# EAGLE design DL-1 (EAGLE 9.6.2)
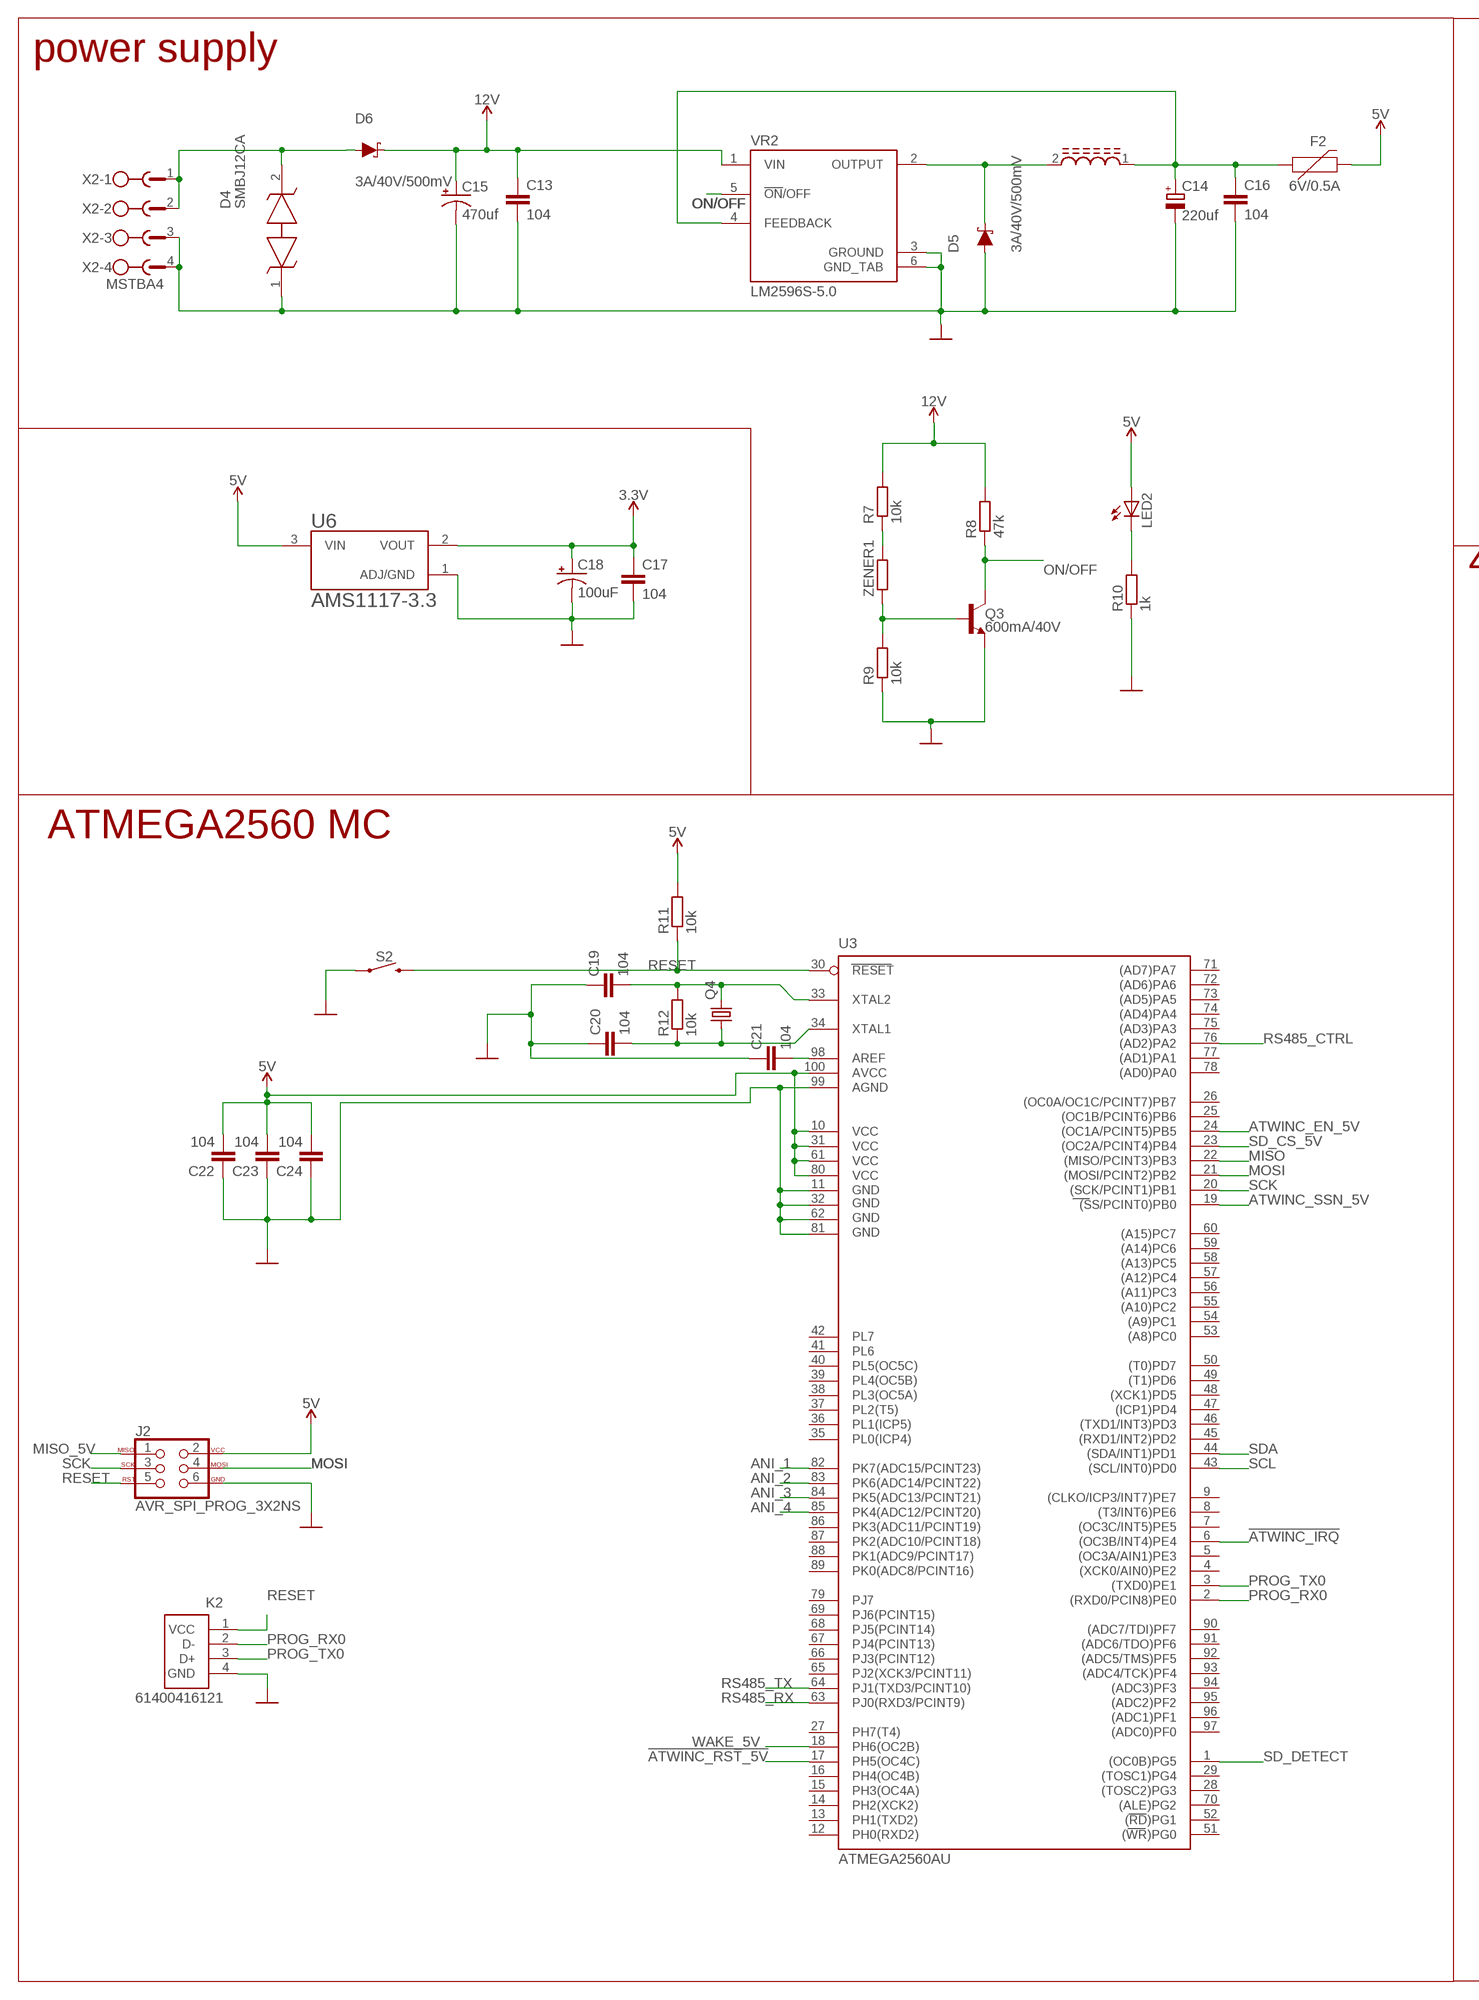
[diagram p0: schematic, sheet 1, part 1 of 2]
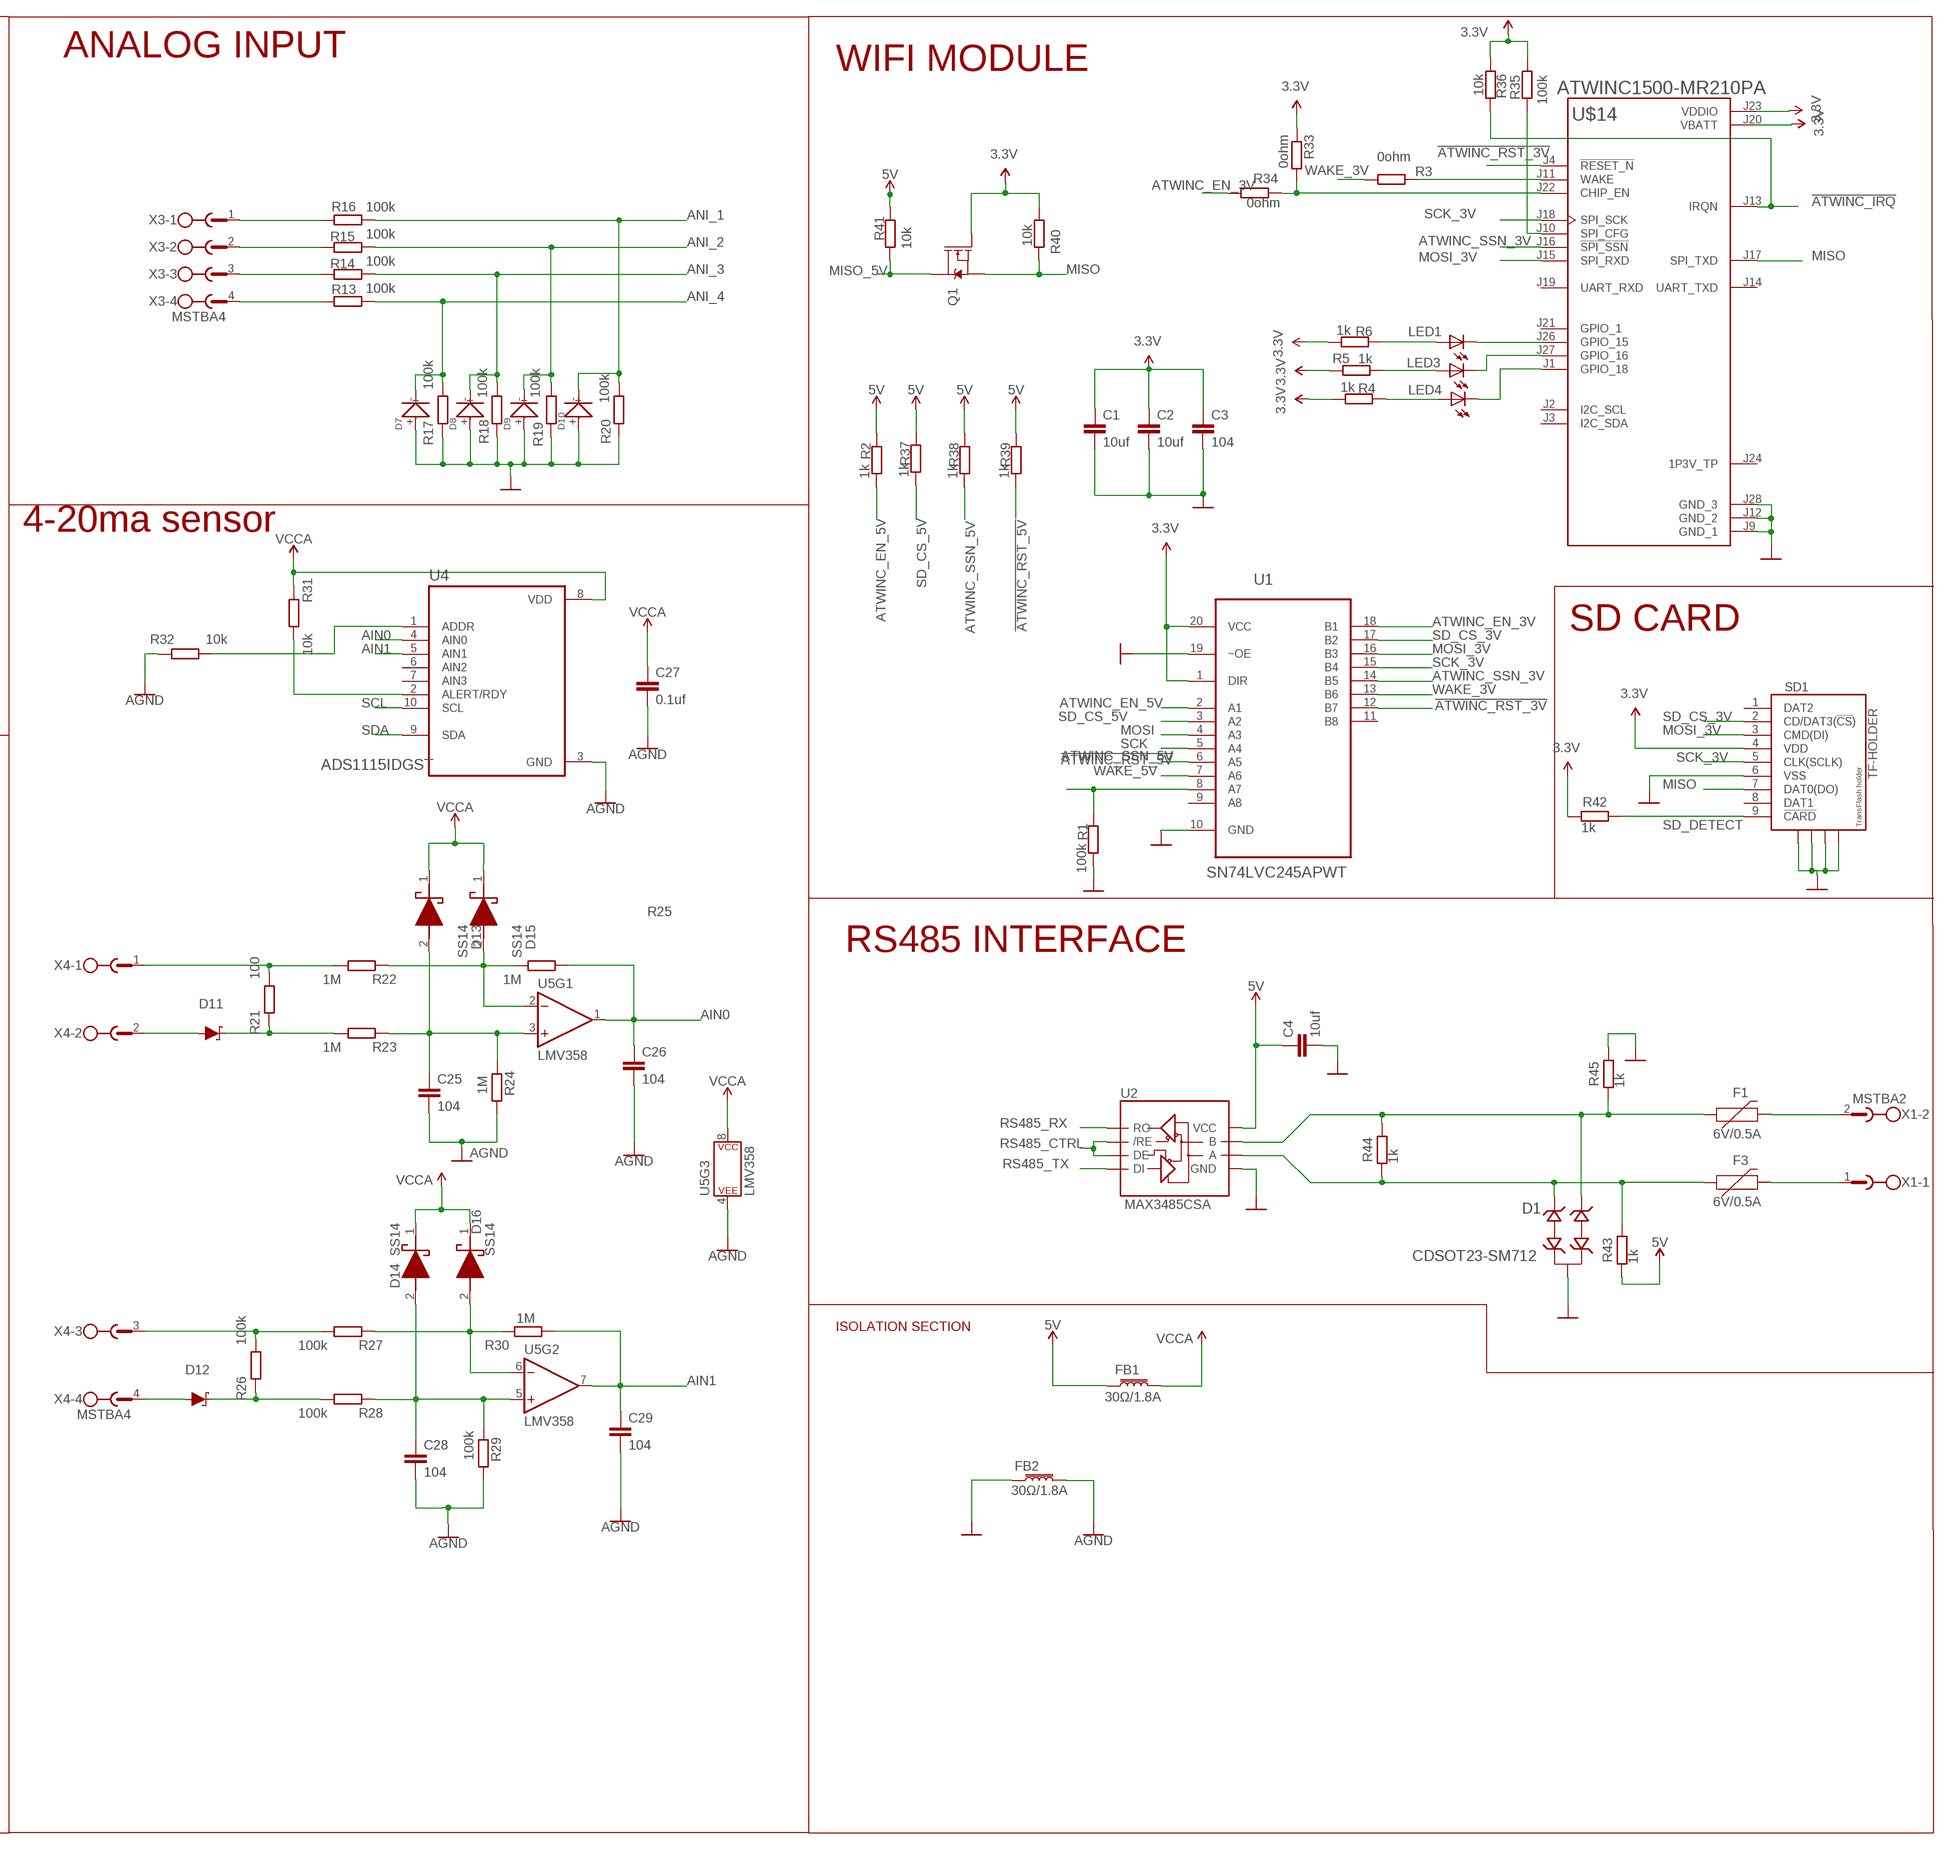
[diagram p1: schematic, sheet 1, part 2 of 2]

## Parts
C1  10uf  C-EUC0805  [C0805]
C2  10uf  C-EUC0805  [C0805]
C3  104  C-EUC0805  [C0805]
C4  10uf  C-EUC0805  [C0805]
C13  104  C-EUC0805  [C0805]
C14  220uf  CPOL-EU153CLV-1014  [153CLV-1014]
C15  470uf  CPOL-USE5-8.5  [E5-8,5]
C16  104  C-EUC0805  [C0805]
C17  104  C-EUC0805  [C0805]
C18  100uF  100UF-POLAR-10X10.5-63V-20%  [NIC_10X10.5_CAP]
C19  104  C-EUC0805  [C0805]
C20  104  C-EUC0805  [C0805]
C21  104  C-EUC0805  [C0805]
C22  104  C-EUC0805  [C0805]
C23  104  C-EUC0805  [C0805]
C24  104  C-EUC0805  [C0805]
C25  104  C-EUC0805  [C0805]
C26  104  C-EUC0805  [C0805]
C27  0.1uf  C-EUC0805  [C0805]
C28  104  C-EUC0805  [C0805]
C29  104  C-EUC0805  [C0805]
D1  CDSOT23-SM712  [SOT-23-3]
D4  SMBJ12CA  [DIONM5443X244N]
D5  3A/40V/500mV  DIODE-SCHOTTKY-B340A  [SMA-DIODE]
D6  3A/40V/500mV  DIODE-SCHOTTKY-B340A  [SMA-DIODE]
D7  SMD-DIODE-ZENER-5.1V-500MW(SOD-123)  [SOD-123]
D8  SMD-DIODE-ZENER-5.1V-500MW(SOD-123)  [SOD-123]
D9  SMD-DIODE-ZENER-5.1V-500MW(SOD-123)  [SOD-123]
D10  SMD-DIODE-ZENER-5.1V-500MW(SOD-123)  [SOD-123]
D11  3A/40V/500mV  DIODE-SCHOTTKY-B340A  [SMA-DIODE]
D12  3A/40V/500mV  DIODE-SCHOTTKY-B340A  [SMA-DIODE]
D13  SS14  [DIOM5227X270N]
D14  SS14  [DIOM5227X270N]
D15  SS14  [DIOM5227X270N]
D16  SS14  [DIOM5227X270N]
F1  6V/0.5A  PPTC_HALF-AMP  [1206]
F2  6V/0.5A  PPTC_HALF-AMP  [1206]
F3  6V/0.5A  PPTC_HALF-AMP  [1206]
FB1  30Ω/1.8A  FERRITE_BEAD-0603  [0603]
FB2  30Ω/1.8A  FERRITE_BEAD-0603  [0603]
J2  AVR_SPI_PROG_3X2NS  [2X3-NS]
K2  61400416121  [61400416121]
L2  SRR1260-680M  [INDP125125X600N]
LED1  LEDCHIP-LED0805  [CHIP-LED0805]
LED2  LEDCHIP-LED0805  [CHIP-LED0805]
LED3  LEDCHIP-LED0805  [CHIP-LED0805]
LED4  LEDCHIP-LED0805  [CHIP-LED0805]
Q1  220mA/50V/3.5Ω  MOSFET-NCH-BSS138  [SOT23-3]
Q3  600mA/40V  TRANS_NPN-MMBT2222AL  [SOT23-3]
Q4  CRYSTALHC49S  [HC49/S]
R1  100k  R-EU_M0805  [M0805]
R2  1k  R-EU_M0805  [M0805]
R3  0ohm  R-EU_M0805  [M0805]
R4  1k  R-EU_M0805  [M0805]
R5  1k  R-EU_M0805  [M0805]
R6  1k  R-EU_M0805  [M0805]
R7  10k  R-EU_M0805  [M0805]
R8  47k  R-EU_M0805  [M0805]
R9  10k  R-EU_M0805  [M0805]
R10  1k  R-EU_M0805  [M0805]
R11  10k  R-EU_M0805  [M0805]
R12  10k  R-EU_M0805  [M0805]
R13  100k  R-EU_M0805  [M0805]
R14  100k  R-EU_M0805  [M0805]
R15  100k  R-EU_M0805  [M0805]
R16  100k  R-EU_M0805  [M0805]
R17  100k  R-EU_M0805  [M0805]
R18  100k  R-EU_M0805  [M0805]
R19  100k  R-EU_M0805  [M0805]
R20  100k  R-EU_M0805  [M0805]
R21  100  R-EU_M0805  [M0805]
R22  1M  R-EU_M0805  [M0805]
R23  1M  R-EU_M0805  [M0805]
R24  1M  R-EU_M0805  [M0805]
R25  1M  R-EU_M0805  [M0805]
R26  100k  R-EU_M0805  [M0805]
R27  100k  R-EU_M0805  [M0805]
R28  100k  R-EU_M0805  [M0805]
R29  100k  R-EU_M0805  [M0805]
R30  1M  R-EU_M0805  [M0805]
R31  10k  R-EU_M0805  [M0805]
R32  10k  R-EU_M0805  [M0805]
R33  0ohm  R-EU_M0805  [M0805]
R34  0ohm  R-EU_M0805  [M0805]
R35  100k  R-EU_M0805  [M0805]
R36  10k  R-EU_M0805  [M0805]
R37  1k  R-EU_M0805  [M0805]
R38  1k  R-EU_M0805  [M0805]
R39  1k  R-EU_M0805  [M0805]
R40  10k  R-EU_M0805  [M0805]
R41  10k  R-EU_M0805  [M0805]
R42  1k  R-EU_M0805  [M0805]
R43  1k  R-EU_M0805  [M0805]
R44  1k  R-EU_M0805  [M0805]
R45  1k  R-EU_M0805  [M0805]
S2  MOMENTARY-SWITCH-SPST-SMD-6.0X3.5MM  [TACTILE_SWITCH_SMD_6.0X3.5MM]
SD1  TF-HOLDER  [TF-PULL]
U1  SN74LVC245APWT  [SOP65P640X120-20N]
U2  MAX3485CSA  RS485SOIC  [SO08]
U3  ATMEGA2560AU  [TQFP100]
U4  ADS1115IDGST  [SOP50P490X110-10N]
U5  LMV358  LMV358SOIC  [SO08]
U6  AMS1117-3.3  [SOT229P700X180-4N]
U$14  ATWINC1500-MR210PA  [ATMEL_ATWINC1500-MR210PA]
VR2  LM2596S-5.0  [TO170P1524X483-6N]
X1  MSTBA2  [MSTBA2]
X2  MSTBA4  [MSTBA4]
X3  MSTBA4  [MSTBA4]
X4  MSTBA4  [MSTBA4]
ZENER1  R-EU_0204/7  [0204/7]

## Nets
3.3V: C1.1 C2.1 C3.1 C17.1 C18.+ Q1.1(G) R4.2 R5.2 R6.2 R33.1 R35.1 R36.1 R40.1 R42.1 SD1.4(VDD) U1.1(DIR) U1.20(VCC) U6.2(VOUT) U$14.J20(VBATT) U$14.J23(VDDIO)
5V: C4.1 C22.2 C23.2 C24.2 F2.2 FB1.1 J2.2 LED2.A R2.1 R11.2 R37.1 R38.1 R39.1 R41.1 R43.1 U2.8(VCC) U3.10(VCC) U3.31(VCC1) U3.61(VCC2) U3.80(VCC3) U3.100(AVCC) U6.3(VIN)
12V: C13.1 C15.+ D6.C R7.2 R8.2 VR2.1(VIN)
!ATWINC_IRQ: R36.2 U3.6((OC3B/INT4)PE4) U$14.J13(IRQN)
!ATWINC_RST_3V: U1.12(B7) U$14.J4(!RESET_N)
!ATWINC_RST_5V: R1.1 R39.2 U1.8(A7) U3.17(PH5(OC4C))
AGND: C25.2 C26.2 C27.2 C28.2 C29.2 FB2.2 R24.1 R29.1 R32.1 U4.3(GND) U5.4(P$V-)
AIN0: C26.1 R25.1 U4.4(AIN0) U5.1(OUT)
AIN1: C29.1 R30.1 U4.5(AIN1) U5.7(OUT)
ANI_1: D10.- R16.1 R20.2 U3.82(PK7(ADC15/PCINT23))
ANI_2: D9.- R15.1 R19.2 U3.83(PK6(ADC14/PCINT22))
ANI_3: D8.- R14.1 R18.2 U3.84(PK5(ADC13/PCINT21))
ANI_4: D7.- R13.1 R17.2 U3.85(PK4(ADC12/PCINT20))
ATWINC_EN_3V: R34.1 U1.18(B1)
ATWINC_EN_5V: R2.2 U1.2(A1) U3.24((OC1A/PCINT5)PB5)
ATWINC_SSN_3V: U1.14(B5) U$14.J16(!SPI_SSN)
ATWINC_SSN_5V: R38.2 U1.6(A5) U3.19((SS/PCINT0)PB0)
GND: C1.2 C2.2 C3.2 C4.2 C13.2 C14.- C15.- C16.2 C17.2 C18.- C19.1 C20.1 C21.1 C22.1 C23.1 C24.1 D1.3(GND) D4.1 D5.A D7.+ D8.+ D9.+ D10.+ FB2.1 J2.6 K2.4(GND) Q3.2(E) R1.2 R9.1 R10.1 R17.1 R18.1 R19.1 R20.1 R45.2 S2.1 SD1.6(VSS) SD1.S1 SD1.S2 SD1.S3 SD1.S4 U1.10(GND) U1.19(~OE) U2.5(GND) U3.11(GND) U3.32(GND1) U3.62(GND2) U3.81(GND3) U3.99(AGND) U6.1(ADJ/GND) U$14.J9(GND_1) U$14.J12(GND_2) U$14.J28(GND_3) VR2.3(GROUND) VR2.6(GND_TAB) X2.3 X2.4
MISO: Q1.2(S) R40.2 SD1.7(DAT0(DO)) U3.22((MISO/PCINT3)PB3) U$14.J17(SPI_TXD)
MISO_5V: J2.1 Q1.3(D) R41.2
MOSI: J2.4 U1.4(A3) U3.21((MOSI/PCINT2)PB2)
MOSI_3V: SD1.3(CMD(DI)) U1.16(B3) U$14.J15(SPI_RXD)
N$1: LED1.C U$14.J26(GPIO_15)
N$2: LED3.C U$14.J27(GPIO_16)
N$3: D5.C L2.2 VR2.2(OUTPUT)
N$4: LED3.A R5.1
N$5: LED1.A R6.1
N$6: LED4.C U$14.J1(GPIO_18)
N$7: LED4.A R4.1
N$8: D1.2(IO2) F1.1 R44.2 R45.1 U2.7(B)
N$9: R3.1 U$14.J11(WAKE)
N$10: R35.2 U$14.J10(SPI_CFG)
N$11: C14.+ C16.1 F2.1 L2.1 VR2.4(FEEDBACK)
N$12: D4.2 D6.A X2.1 X2.2
N$13: LED2.C R10.2
N$14: Q3.1(B) R9.2 ZENER1.1
N$15: R7.1 ZENER1.2
N$16: C20.2 Q4.1 R12.1 U3.34(XTAL1)
N$17: C19.2 Q4.2 R12.2 U3.33(XTAL2)
N$18: C21.2 U3.98(AREF)
N$19: R13.2 X3.4
N$20: R14.2 X3.3
N$21: R15.2 X3.2
N$22: R16.2 X3.1
N$23: R21.2 R22.2 X4.1
N$24: D11.C R21.1 R23.2
N$25: C25.1 D13.2(A) R23.1 R24.2 U5.3(+IN)
N$26: D15.2(A) R22.1 R25.2 U5.2(-IN)
N$27: D11.A X4.2
N$28: R26.2 R27.2 X4.3
N$29: D12.C R26.1 R28.2
N$30: C28.1 D14.2(A) R28.1 R29.2 U5.5(+IN)
N$31: D16.2(A) R27.1 R30.2 U5.6(-IN)
N$32: D12.A X4.4
N$33: R31.2 U4.2(ALERT/RDY)
N$34: R32.2 U4.1(ADDR)
N$35: D1.1(IO1) F3.1 R43.2 R44.1 U2.6(A)
N$36: R33.2 R34.2 U$14.J22(CHIP_EN)
N$37: F1.2 X1.2
N$38: F3.2 X1.1
ON/OFF: Q3.3(C) R8.1 VR2.5(!ON!/OFF)
PROG_RX0: K2.2(D-) U3.2((RXD0/PCIN8)PE0)
PROG_TX0: K2.3(D+) U3.3((TXD0)PE1)
RESET: J2.5 K2.1(VCC) R11.1 S2.2 U3.30(RESET)
RS485_CTRL: U2.2(/RE) U2.3(DE) U3.76((AD2)PA2)
RS485_RX: U2.1(RO) U3.63(PJ0(RXD3/PCINT9))
RS485_TX: U2.4(DI) U3.64(PJ1(TXD3/PCINT10))
SCK: J2.3 U1.5(A4) U3.20((SCK/PCINT1)PB1)
SCK_3V: SD1.5(CLK(SCLK)) U1.15(B4) U$14.J18(SPI_SCK)
SCL: U3.43((SCL/INT0)PD0) U4.10(SCL)
SD_CS_3V: SD1.2(CD/DAT3(!CS!)) U1.17(B2)
SD_CS_5V: R37.2 U1.3(A2) U3.23((OC2A/PCINT4)PB4)
SD_DETECT: R42.2 SD1.9(!CARD) U3.1((OC0B)PG5)
SDA: U3.44((SDA/INT1)PD1) U4.9(SDA)
VCCA: C27.1 D13.1(K) D14.1(K) D15.1(K) D16.1(K) FB1.2 R31.1 U4.8(VDD) U5.8(P$V+)
WAKE_3V: R3.2 U1.13(B6)
WAKE_5V: U1.7(A6) U3.18(PH6(OC2B))
Unconnected: SD1.1(DAT2) SD1.8(DAT1) U1.9(A8) U1.11(B8) U3.4((XCK0/AIN0)PE2) U3.5((OC3A/AIN1)PE3) U3.7((OC3C/INT5)PE5) U3.8((T3/INT6)PE6) U3.9((CLKO/ICP3/INT7)PE7) U3.12(PH0(RXD2)) U3.13(PH1(TXD2)) U3.14(PH2(XCK2)) U3.15(PH3(OC4A)) U3.16(PH4(OC4B)) U3.25((OC1B/PCINT6)PB6) U3.26((OC0A/OC1C/PCINT7)PB7) U3.27(PH7(T4)) U3.28((TOSC2)PG3) U3.29((TOSC1)PG4) U3.35(PL0(ICP4)) U3.36(PL1(ICP5)) U3.37(PL2(T5)) U3.38(PL3(OC5A)) U3.39(PL4(OC5B)) U3.40(PL5(OC5C)) U3.41(PL6) U3.42(PL7) U3.45((RXD1/INT2)PD2) U3.46((TXD1/INT3)PD3) U3.47((ICP1)PD4) U3.48((XCK1)PD5) U3.49((T1)PD6) U3.50((T0)PD7) U3.51((WR)PG0) U3.52((RD)PG1) U3.53((A8)PC0) U3.54((A9)PC1) U3.55((A10)PC2) U3.56((A11)PC3) U3.57((A12)PC4) U3.58((A13)PC5) U3.59((A14)PC6) U3.60((A15)PC7) U3.65(PJ2(XCK3/PCINT11)) U3.66(PJ3(PCINT12)) U3.67(PJ4(PCINT13)) U3.68(PJ5(PCINT14)) U3.69(PJ6(PCINT15)) U3.70((ALE)PG2) U3.71((AD7)PA7) U3.72((AD6)PA6) U3.73((AD5)PA5) U3.74((AD4)PA4) U3.75((AD3)PA3) U3.77((AD1)PA1) U3.78((AD0)PA0) U3.79(PJ7) U3.86(PK3(ADC11/PCINT19)) U3.87(PK2(ADC10/PCINT18)) U3.88(PK1(ADC9/PCINT17)) U3.89(PK0(ADC8/PCINT16)) U3.90((ADC7/TDI)PF7) U3.91((ADC6/TDO)PF6) U3.92((ADC5/TMS)PF5) U3.93((ADC4/TCK)PF4) U3.94((ADC3)PF3) U3.95((ADC2)PF2) U3.96((ADC1)PF1) U3.97((ADC0)PF0) U4.6(AIN2) U4.7(AIN3) U$14.J2(I2C_SCL) U$14.J3(I2C_SDA) U$14.J14(UART_TXD) U$14.J19(UART_RXD) U$14.J21(GPIO_1) U$14.J24(1P3V_TP)

## Notes on the sheet
- power supply
- ANALOG INPUT
- WIFI MODULE
- 4-20ma sensor
- SD CARD
- ATMEGA2560 MC
- RS485 INTERFACE
- ISOLATION SECTION

## Library data of the parts
C1-C4 C13 C16 C17 C19-C29 = rcl:C-EU: CAPACITOR, European symbol; SPICEPREFIX: C
C14 = rcl:CPOL-EU: POLARIZED CAPACITOR, European symbol; SPICEPREFIX: C
C15 = rcl:CPOL-US: POLARIZED CAPACITOR, American symbol; SPICEPREFIX: C
C18 = SparkFun-Capacitors:100UF-POLAR: 100µF polarized capacitors A capacitor is a passive two-terminal electrical component used to store electrical energy temporarily in an electric field.; PROD_ID: CAP-08362
D1 = PC_Diode_SM712 TVS RS485:CDSOT23-SM712: Bourns CDSOT23-SM712 http://www.bourns.com/docs/Product-Datasheets/CDSOT23-SM712.pdf TVS Protection Didoe for RS-485 as recommended by TI in their RS-485 Reference Guide: http://www.ti.com/lit/sg/slyt484a/slyt484a.pdf; AVAILABILITY: Unavailable; DESCRIPTION: Diode, Smt Tvs Array, 7vrwm & 12vrwm, Sot23 Package; MF: Bourns; MP: CDSOT23-SM712; PACKAGE: SOT-23 Bourns; PRICE: None
D4 = SMBJ12CA:SMBJ12CA: BOURNS - SMBJ12CA - TVS DIODE, 600W, 12V, BIDIR, DO-214AA Source: Datasheet <https://www.mouser.com/ds/2/54/mbj-778392.pdf>; ARROW_PART_NUMBER: SMBJ12CA; ARROW_PRICE-STOCK: https://www.arrow.com/en/products/smbj12ca/bourns; DESCRIPTION: BOURNS - SMBJ12CA - TVS DIODE, 600W, 12V, BIDIR, DO-214AA; HEIGHT: 2.44mm; MANUFACTURER_NAME: Bourns; MANUFACTURER_PART_NUMBER: SMBJ12CA; MOUSER_PART_NUMBER: 652-SMBJ12CA; MOUSER_PRICE-STOCK: https://www.mouser.co.uk/ProductDetail/Bourns/SMBJ12CA/?qs=d7fLapxX37HuPPjHuz97DA%3D%3D
D5 D6 D11 D12 = SparkFun-DiscreteSemi:DIODE-SCHOTTKY: Schottky diode A Schottky diode is a semiconductor diode which has a low forward voltage drop and a very fast switching action.; PROD_ID: DIO-09886
D7-D10 = PC_Diode-Zener-5.1V:SMD-DIODE-ZENER-5.1V-500MW(SOD-123): 304030015; AVAILABILITY: Unavailable; DESCRIPTION: SMD Diode Zener 51.V-500mW; MF: Vishay; MP: MMSZ4689-V-GS08; PACKAGE: SOD-123 Vishay; PRICE: None
D13-D16 = SS14:SS14: 1.0 A Schottky Barrier Rectifiers Source: Datasheet <http://www.onsemi.com/pub/Collateral/SS19-D.pdf>; ARROW_PART_NUMBER: SS14; ARROW_PRICE-STOCK: https://www.arrow.com/en/products/ss14/on-semiconductor; DESCRIPTION: 1.0 A Schottky Barrier Rectifiers; HEIGHT: 2.7mm; MANUFACTURER_NAME: ON Semiconductor; MANUFACTURER_PART_NUMBER: SS14; MOUSER_PART_NUMBER: 512-SS14; MOUSER_PRICE-STOCK: https://www.mouser.co.uk/ProductDetail/ON-Semiconductor-Fairchild/SS14?qs=mVVXn4M53U%252BvrBaFv5vr4w%3D%3D
F1-F3 = SparkFun-Fuses:PPTC: Resettable Fuse PPTC Resettable Fuse. Really a sort of resistor with a polymeric positive temperature coefficient whose resistance increases dramatically with an increase in temperature. When heated by the power passing through the resistance rises causing the current to be limited, protecting the circuit. This is achieved by the transition of the polymer from a crystalline to an amorphous state where the conductive carbon separates breaking the conductive pathways found in the cool crystalline structure. When a PPTC cools back down it resumes conducting letting the circuit turn back on. SparkFun Products: SparkFun RedBoard - Programmed with Arduino <https://www.sparkfun.com/products/12757> Pro Micro - 5V/16MHz <https://www.sparkfun.com/products/12640> Arduino Pro 328 - 5V/16MHz <https://www.sparkfun.com/products/10915> MP3 Trigger <https://www.sparkfun.com/products/13720>; PROD_ID: RES-08585
FB1 FB2 = SparkFun-Coils:FERRITE_BEAD: Ferrite Bead (blocks, cores, rings, chokes, etc.) Inductor with layers of ferrite used to suppress high frequencies. Often used to isolate high frequency noise. SparkFun Products: IOIO-OTG - V2.2 <https://www.sparkfun.com/products/13613> SparkFun SAMD21 Mini Breakout <https://www.sparkfun.com/products/13664> SparkFun 6 Degrees of Freedom Breakout - LSM6DS3 <https://www.sparkfun.com/products/13339> SparkFun SAMD21 Dev Breakout <https://www.sparkfun.com/products/13672>; PROD_ID: NDUC-07859
J2 = SparkFun-Connectors:AVR_SPI_PROG_3X2: AVR ISP 6 Pin This is the reduced ISP connector for AVR programming. Common on Arduino. This footprint will take up less PCB space and can be used with a 10-pin to 6-pin adapter such as SKU: BOB-08508 **Special note about "TEST_POINT" package. The stop mask is on the top side, so if you want your programming test points to be on the bottom of your board, make sure to place this package on the bottom side of the board. This also ensure that the orientation to program from the bottom side will be correct. SparkFun Products: SparkFun ISP Pogo Adapter <https://www.sparkfun.com/products/11591> - NS Tiny AVR Programmer <https://www.sparkfun.com/products/11801> -PTH
K2 = Wuerth_Elektronik_eiCan_Communication_Connectors_v2.2:61400416121: WR-COM Horizontal USB Type B
L2 = SRR1260-680M:SRR1260-680M: Inductor Power Shielded Wirewound 33uH 20% 100KHz 27Q-Factor Ferrite 3A 60mOhm DCR T/R Check prices <https://pricing.snapeda.com/parts/SRR1260-680M/Bourns/view-part?ref=eda>; AVAILABILITY: Good; DESCRIPTION: 68µH Shielded Wirewound Inductor 2.1A 110mOhm Max Nonstandard; MF: Bourns; MP: SRR1260-680M; PACKAGE: Nonstandard Bourns; PRICE: None; PURCHASE-URL: https://pricing.snapeda.com/search/part/SRR1260-680M/?ref=eda
LED1-LED4 = adafruit:LED: LED OSRAM: - CHIPLED LG R971, LG N971, LY N971, LG Q971, LY Q971, LO R971, LY R971 LH N974, LH R974 LS Q976, LO Q976, LY Q976 LO Q996 - Hyper CHIPLED LW Q18S LB Q993, LB Q99A, LB R99A - SideLED LS A670, LO A670, LY A670, LG A670, LP A670 LB A673, LV A673, LT A673, LW A673 LH A674 LY A675 LS A676, LA A676, LO A676, LY A676, LW A676 LS A679, LY A679, LG A679 - Hyper Micro SIDELED® LS Y876, LA Y876, LO Y876, LY Y876 LT Y87S - SmartLED LW L88C, LW L88S LB L89C, LB L89S, LG L890 LS L89K, LO L89K, LY L89K LS L896, LA L896, LO L896, LY L896 - TOPLED LS T670, LO T670, LY T670, LG T670, LP T670 LSG T670, LSP T670, LSY T670, LOP T670, LYG T670 LG T671, LOG T671, LSG T671 LB T673, LV T673, LT T673, LW T673 LH T674 LS T676, LA T676, LO T676, LY T676, LB T676, LH T676, LSB T676, LW T676 LB T67C, LV T67C, LT T67C, LS T67K, LO T67K, LY T67K, LW E67C LS E67B, LA E67B, LO E67B, LY E67B, LB E67C, LV E67C, LT E67C LW T67C LS T679, LY T679, LG T679 LS T770, LO T770, LY T770, LG T770, LP T770 LB T773, LV T773, LT T773, LW T773 LH T774 LS E675, LA E675, LY E675, LS T675 LS T776, LA T776, LO T776, LY T776, LB T776 LHGB T686 LT T68C, LB T68C - Hyper Mini TOPLED® LB M676 - Mini TOPLED Santana® LG M470 LS M47K, LO M47K, LY M47K Source: http://www.osram.convergy.de/
Q1 = SparkFun-DiscreteSemi:MOSFET-NCH: N-channel MOSFETs Voltage controlled devices that allow control of high current outputs. SparkFun Products: SparkFun OpenScale <https://www.sparkfun.com/products/13261> SparkFun Digital Sandbox <https://www.sparkfun.com/products/12651> SparkFun Monster Moto Shield <https://www.sparkfun.com/products/10182> SparkFun MOSFET Power Controller <https://www.sparkfun.com/products/11214>; PROD_ID: TRANS-00830
Q3 = SparkFun-DiscreteSemi:TRANS_NPN: NPN transistor Current controlled devices typically used to amplify current or used as a switch. BC547 - COM-08928 <http://www.sparkfun.com/products/8928> (TO-92 45V 100mA) (1.Collector 2.Base 3.Emitter) 2N3904 - COM-00521 <http://www.sparkfun.com/products/521> (TO-92 40V 200mA) (1.Emitter 2.Base 3.Collector) P2N2222A - COM-12852 <http://www.sparkfun.com/products/12852> (TO-92 40V 600mA) (1.Collector 2.Base 3.Emitter); PROD_ID: TRANS-08049
Q4 = adafruit:CRYSTAL: CRYSTAL; OC_FARNELL: 1667008; OC_NEWARK: unknown
R1-R45 ZENER1 = rcl:R-EU_: RESISTOR, European symbol; SPICEPREFIX: R
S2 = SparkFun-Switches:MOMENTARY-SWITCH-SPST: Momentary Switch (Pushbutton) - SPST Normally-open (NO) SPST momentary switches (buttons, pushbuttons). Variants PTH-12MM - 12mm square, through-hole Momentary Pushbutton Switch - 12mm Square <https://www.sparkfun.com/products/9190> (COM-09190) PTH-6.0MM, PTH-6.0MM-KIT - 6.0mm square, through-hole Mini Pushbutton Switch <https://www.sparkfun.com/products/97> (COM-00097) KIT package intended for soldering kit's - only one side of pads' copper is exposed. PTH-RIGHT-ANGLE-KIT - Right-angle, through-hole Right Angle Tactile Button <https://www.sparkfun.com/products/10791> - Used on SparkFun BigTime Watch Kit <https://www.sparkfun.com/products/11734> SMD-12MM - 12mm square, surface-mount Tactile Button - SMD (12mm) <https://www.sparkfun.com/products/12993> (COM-12993) Used on SparkFun PicoBoard <https://www.sparkfun.com/products/11888> SMD-4.5MM - 4.5mm Square Trackball Switch Used on SparkFun Blackberry Trackballer Breakout <https://www.sparkfun.com/products/13169> SMD-4.6MMX2.8MM - 4.60mm x 2.80mm, surface mount Used on SparkFun SAMD21 Mini Breakout <https://www.sparkfun.com/products/13664> SMD-5.2MM, SMD-5.2-REDUNDANT - 5.2mm square, surface-mount Mini Pushbutton Switch - SMD <https://www.sparkfun.com/products/8720> (COM-08720) Used on Arduino Pro Mini <https://www.sparkfun.com/products/11114> REDUNDANT package connects both switch circuits together SMD-6.0X3.5MM - 6.0 x 3.5mm, surface mount Momentary Reset Switch SMD <https://www.sparkfun.com/products/8229> (COM-08229) SMD-6.2MM-TALL - 6.2mm square, surface mount Tactile Button - SMD (6mm) <https://www.sparkfun.com/products/12992> Used on SparkFun Digital Sandbox <https://www.sparkfun.com/products/12651> SMD-RIGHT-ANGLE - Right-angle, surface mount Used on SparkFun Block for Intel® Edison - Arduino <https://www.sparkfun.com/products/13036>; PROD_ID: SWCH-00815; SF_SKU: COM-08229
SD1 = PC_Connector_SD_Holder:TF-HOLDER: TF / Micro SD socket is PUSH-PUSH type, the card can be pushed into and auto locked and pushed out by simply press the card. Surface Mounting type.
U1 = PC_IC_SN74LVC245APWT:SN74LVC245APWT: OCTAL BUS TRANSCEIVER WITH 3-STATE OUTPUTS; AVAILABILITY: Unavailable; DESCRIPTION: Octal Bus Transceiver With 3-State Outputs 20-TSSOP -40 to 125; MF: Texas Instruments; MP: SN74LVC245APWT; PACKAGE: TSSOP-20 Texas Instruments; PRICE: None
U2 = SparkFun-IC-Comms:RS485: RS-485 Transceiver SP3485 Series 8 Pin NSOIC 3.3 V Low Power Half Duplex RS-485 Transceiver MAX3485 compatible Datasheet <http://www.sparkfun.com/datasheets/Components/General/sp3485CN-LTR.pdf> SparkFun Products SparkFun Transceiver Breakout - RS-485 <https://www.sparkfun.com/products/10124> (BOB-10124) SparkFun USB to RS-485 Converter <https://www.sparkfun.com/products/9822> (BOB-09822); PROD_ID: IC-09388
U3 = SparkFun-IC-Microcontroller:ATMEGA2560: Atmel 100-pin 8-bit uC 64/128/256 Kbytes FLASH 4 Kbytes EEPROM 8 Kbytes SRAM 86 General Purpose I/O pins 12-channels16-bit PWM 4 x Serial USARTs 16-channels 10-bit A/D SparkFun Products None.; PROD_ID: IC-10040
U4 = ADS1115IDGST:ADS1115IDGST: Check prices <https://pricing.snapeda.com/parts/ADS1115IDGST/Texas%20Instruments/view-part?ref=eda>; AVAILABILITY: Good; DESCRIPTION: 16-Bit 860SPS 4-Ch Delta-Sigma ADC With PGA, Oscillator, Vref, Comparator, and I2C 10-VSSOP -40 to 125; MF: Texas Instruments; MP: ADS1115IDGST; PACKAGE: VSSOP-10 Texas Instruments; PRICE: None; PURCHASE-URL: https://pricing.snapeda.com/search/part/ADS1115IDGST/?ref=eda
U5 = SparkFun-IC-Amplifiers:LMV358: IC LMV358 DUAL OP AMP Jellybean rail-to-rail output op-amp SparkFun Products SparkFun PicoBoard <https://www.sparkfun.com/products/11888> (WIG-11888) SparkFun Vernier Interface Shield <https://www.sparkfun.com/products/12858> (DEV-12858) SparkFun Blynk Board - ESP8266 <https://www.sparkfun.com/products/13794> (WRL-13794) SparkFun Digital Sandbox <https://www.sparkfun.com/products/12651> (DEV-12651 RoHS); PROD_ID: IC-09657
U6 = PC_Regulator_AMS1117-3.3:AMS1117-3.3: Sot223/Pkg 1-Amp 3.3-Volt Low Drop Out Voltage Regulatator; AVAILABILITY: Unavailable; DESCRIPTION: Sot223/Pkg 1-Amp 3.3-Volt Low Drop Out Voltage Regulatator; MF: Advanced Monolithic Systems; MP: AMS1117-3.3; PACKAGE: None; PRICE: None
U$14 = ATWINC1500-MR210PA:ATWINC1500-MR210PA: Certified Module with ATWINC1500A-Mu Chip and PCB Antenna Check prices <https://pricing.snapeda.com/parts/ATWINC1500-MR210PA/Microchip/view-part?ref=eda>; AVAILABILITY: Bad; DESCRIPTION: WiFi 802.11b/g/n Transceiver Module 2.4GHz Integrated, Trace Surface Mount; MF: Microchip; MP: ATWINC1500-MR210PA; PACKAGE: SMD-28 Microchip Technology; PRICE: None
VR2 = LM2596S-5.0:LM2596S-5.0: Check prices <https://pricing.snapeda.com/parts/LM2596S-5.0/Texas/view-part?ref=eda>; AVAILABILITY: Warning; DESCRIPTION: SIMPLE SWITCHER&reg; 4.5V to 40V, 3A Low Component Count Step-Down Regulator 5-DDPAK/TO-263; MF: Texas; MP: LM2596S-5.0; PACKAGE: TO-263-6 NEC; PRICE: None; PURCHASE-URL: https://pricing.snapeda.com/search/part/LM2596S-5.0/?ref=eda
X1 = con-phoenix-508:MSTBA2: PHOENIX; MF: FARNELL; MPN: 1757242; OC_FARNELL: 3705171; OC_NEWARK: 71C4161
X2-X4 = con-phoenix-508:MSTBA4: PHOENIX; MF: FARNELL; MPN: 1757268; OC_FARNELL: 3705195; OC_NEWARK: 71C4163

## Board
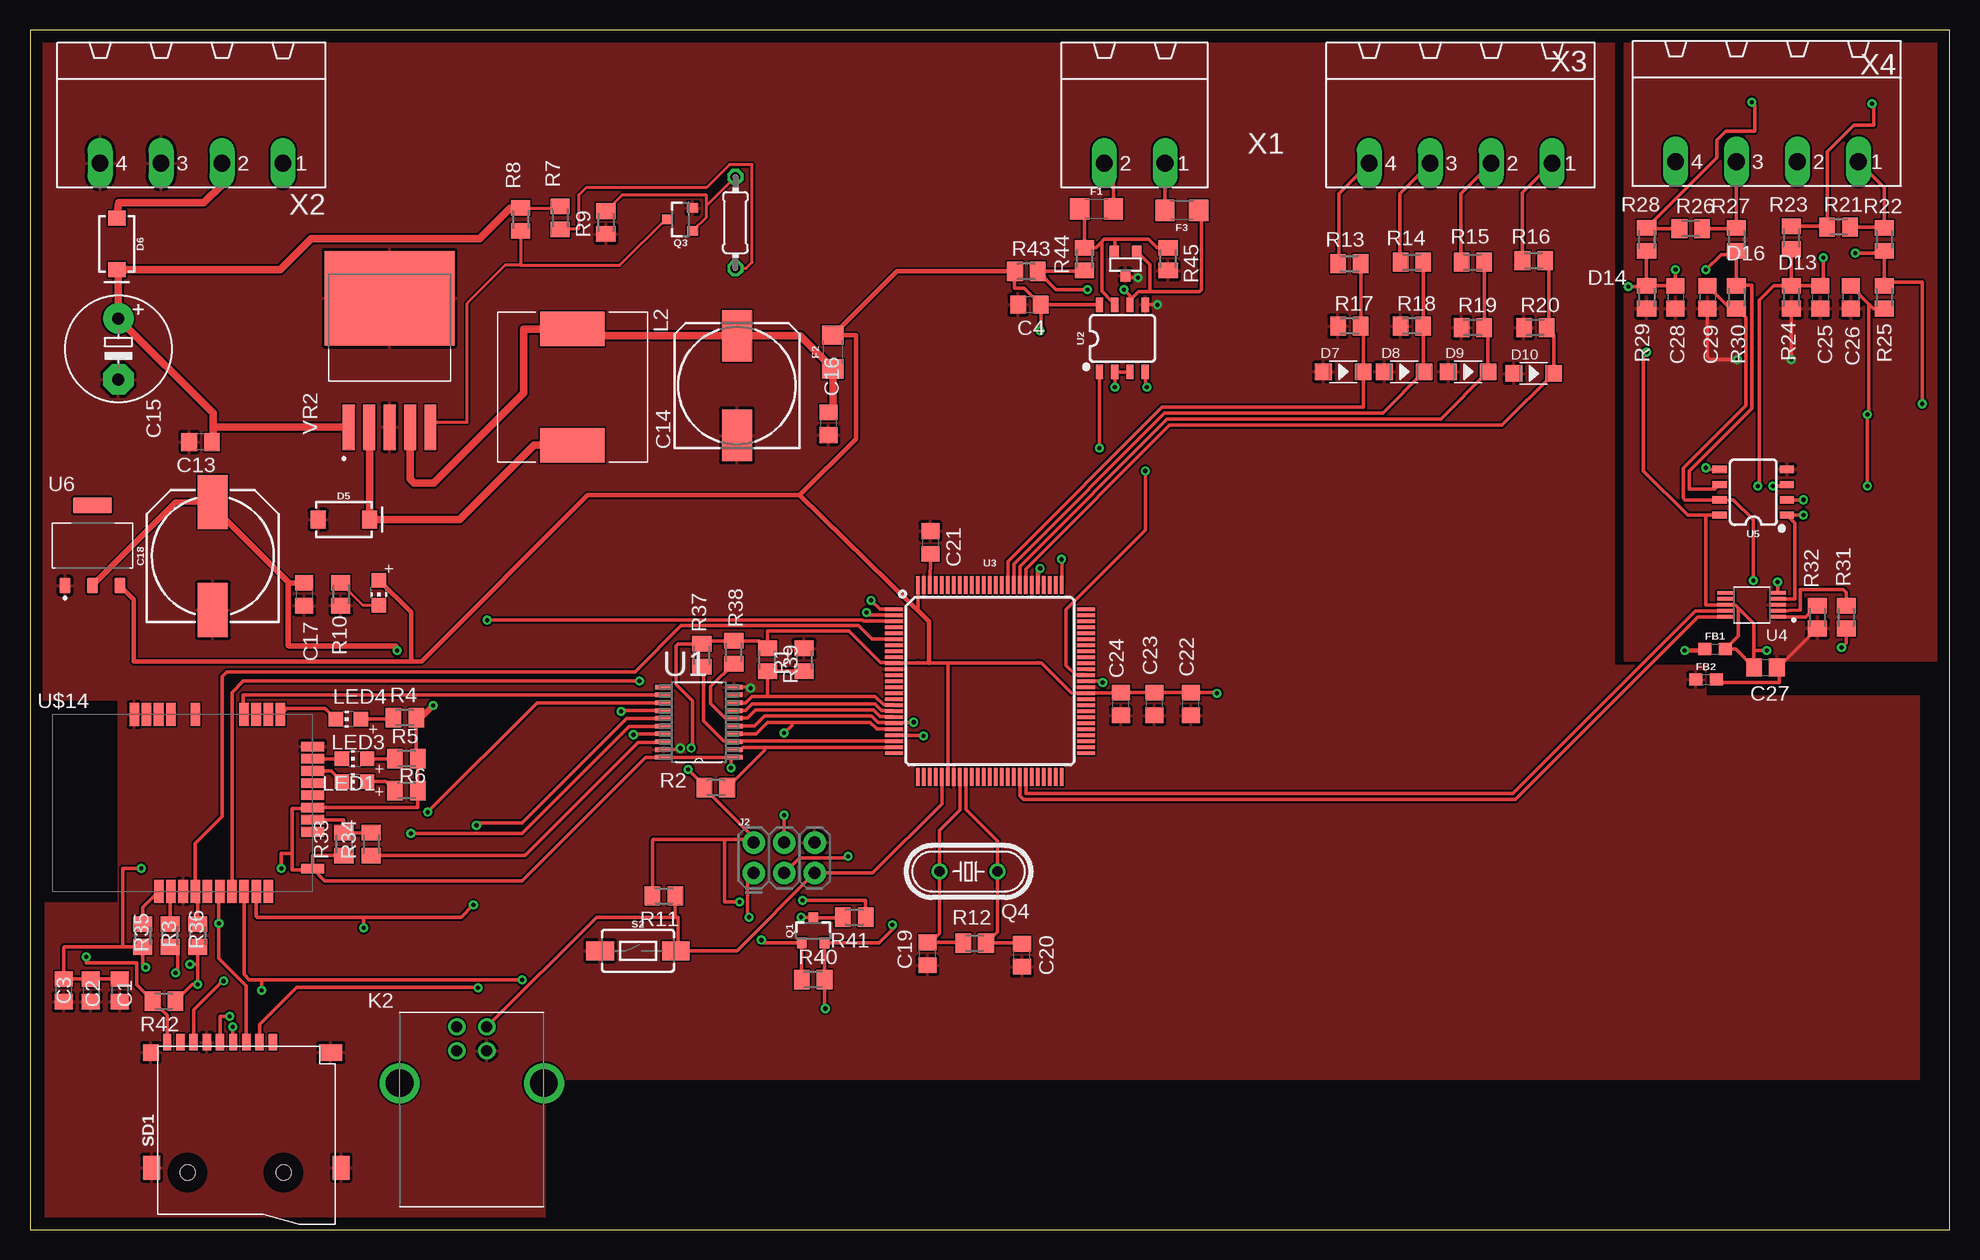
[diagram p2: board, top side]
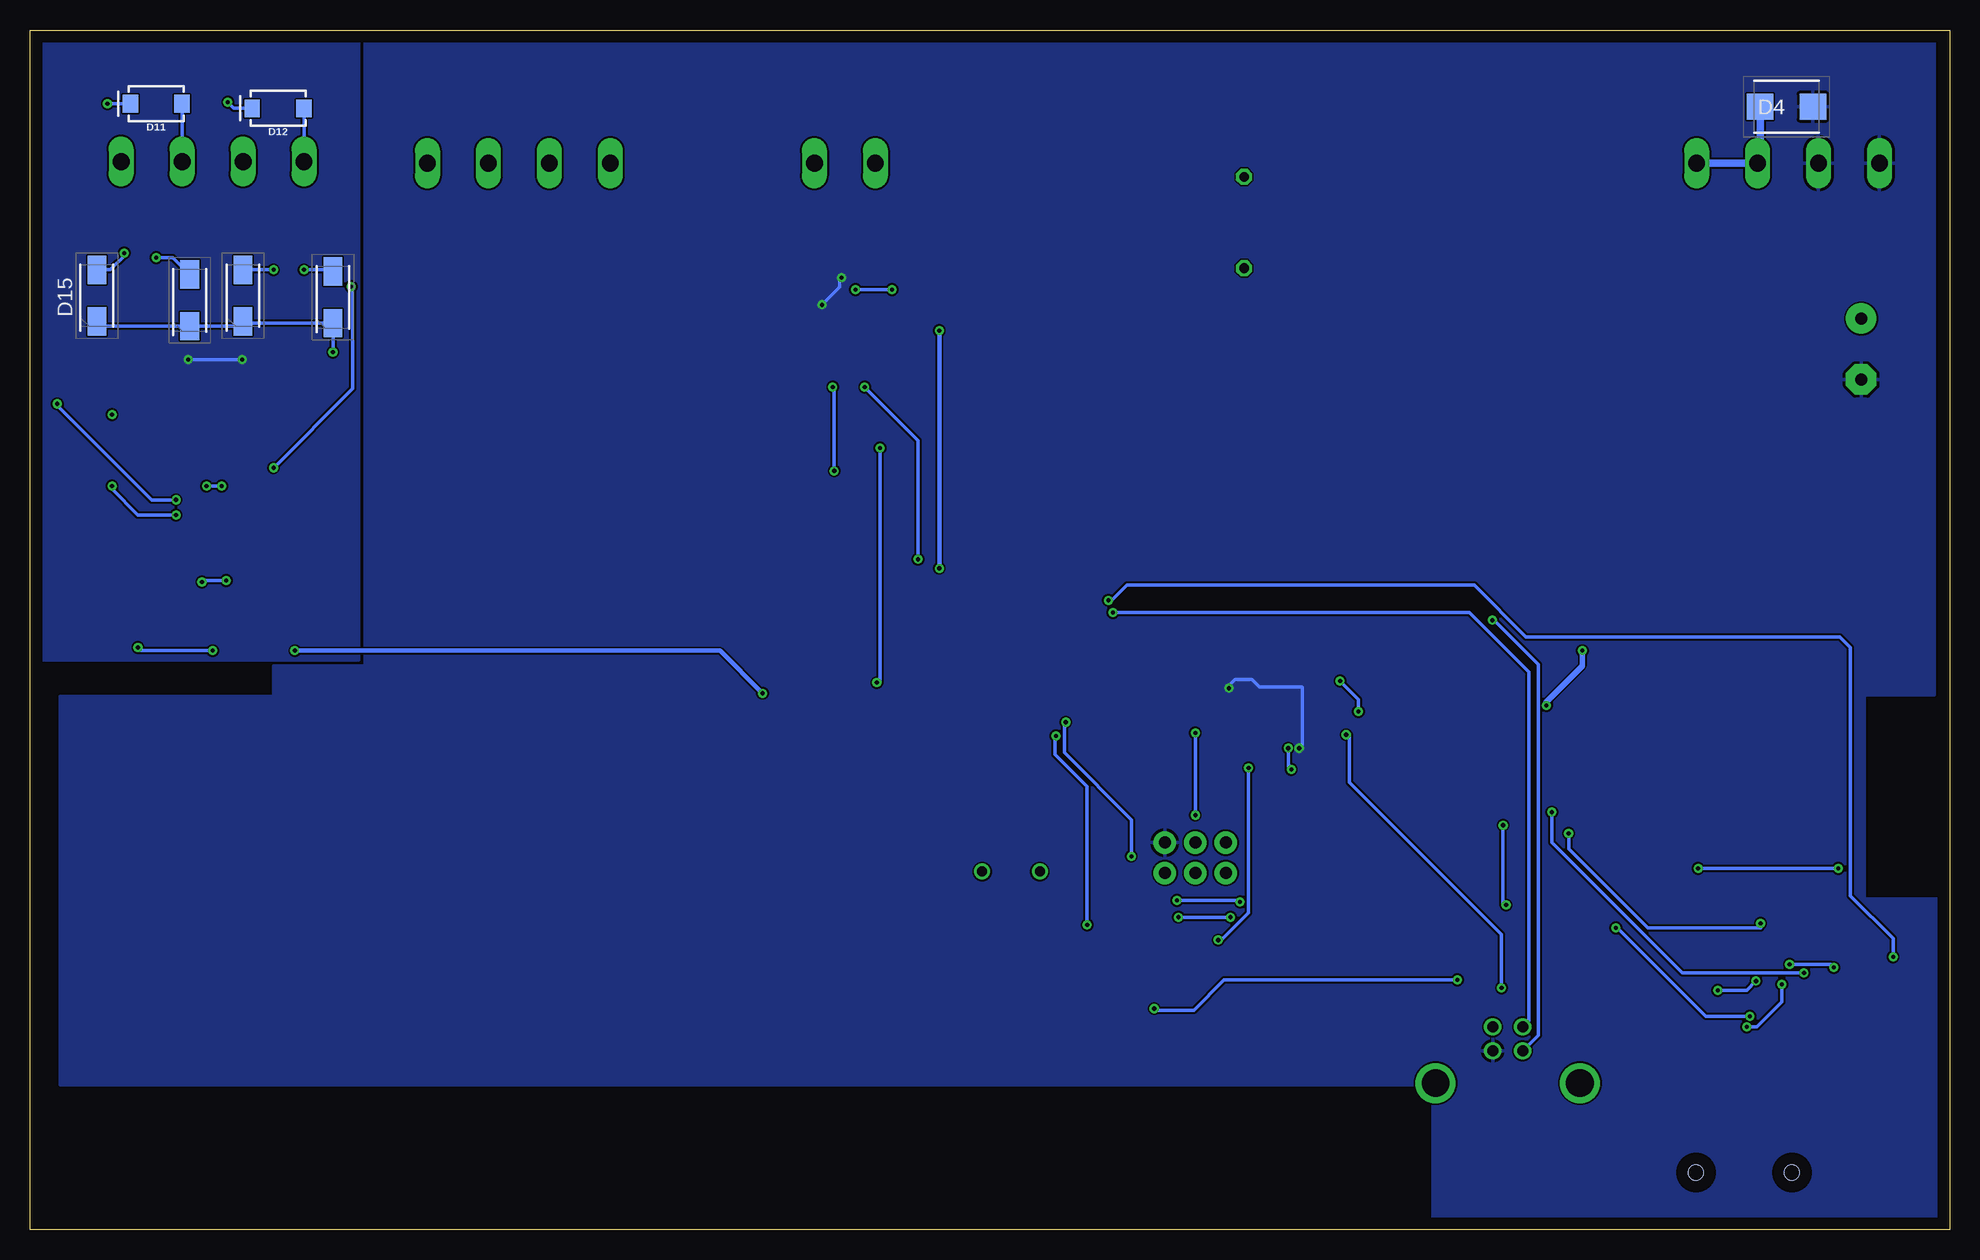
[diagram p3: board, bottom side, seen from below]

Size 160 x 100 mm. Coordinates in mm from the lower left corner, seen from the top.
Outline: 0,0 160,0 160,100 0,100 0,0
Copper layers (1*16): Top 0.035mm / dielectric 1.5mm / Bottom 0.035mm
Design rules "default": minimum track width 6mil, minimum drill 0.35mm, track to track 6mil, track to pad 6mil, pad to pad 6mil, via to via 6mil, smd to smd 6mil, copper to edge 40mil, drill to drill 6mil, minimum pad ring 10mil, minimum via ring 8mil, stop-mask expansion 4mil, vias tented up to drill 0mil, thermal gap 10mil

### Footprints (pad centres in the part's own frame; a part is rotated, then mirrored left to right if it is on the bottom)
C0805 = smd 1.3 x 1.5: 1 -0.95,0; 2 0.95,0
153CLV-1014 = smd 4.3 x 2.5: + 4.15,0; - -4.15,0
E5-8,5 = drill 1.016 pad 2.54: + -2.54,0 | drill 1.016 pad 2.54 octagon: - 2.54,0
NIC_10X10.5_CAP = smd 4.5 x 2.5: + 4.5,0; - -4.5,0
SOT-23-3 = smd 0.802 x 0.972: 1 -0.95,-1; 2 0.95,-1; 3 0,1
DIONM5443X244N = smd 2.2 x 2.15: 1 -2.2,0; 2 2.2,0
SMA-DIODE = smd 1.27 x 1.47: A -2.15,0; C 2.15,0
SOD-123 = smd 1.397 x 1.397: + -1.651,0; - 1.651,0
DIOM5227X270N = smd 2.35 x 1.55: 1 -2.15,0; 2 2.15,0
1206 = smd 1.6 x 1.8: 1 -1.4,0; 2 1.4,0
0603 = smd 1.1 x 1: 1 -0.85,0; 2 0.85,0
2X3-NS = drill 1.016 pad 1.88: 1 -2.54,-1.27; 2 -2.54,1.27; 3 0,-1.27; 4 0,1.27; 5 2.54,-1.27; 6 2.54,1.27
61400416121 = drill 0.92: 1 1.25,4.71; 2 -1.25,4.71; 3 -1.25,2.71; 4 1.25,2.71 | drill 2.3: Z1 -6.02,0; Z2 6.02,0
INDP125125X600N = smd 2.9 x 5.4: 1 -4.85,0; 2 4.85,0
CHIP-LED0805 = smd 1.2 x 1.2: A 0,-1.05; C 0,1.05
SOT23-3 = smd 0.8 x 0.9: 1 -0.95,-1; 2 0.95,-1; 3 0,1.1
HC49/S = drill 0.813: 1 -2.413,0; 2 2.413,0
M0805 = smd 1.3 x 1.6: 1 -0.95,0; 2 0.95,0
TACTILE_SWITCH_SMD_6.0X3.5MM = smd 2.3 x 1.6: 1 -3.15,0; 2 3.15,0
TF-PULL = smd 0.7 x 1.4: 1 -2.2,-7.62; 2 -1.1,-7.62; 3 0,-7.62; 4 1.1,-7.62; 5 2.2,-7.62; 6 3.3,-7.62; 7 4.4,-7.62; 8 5.5,-7.62; 9 6.6,-7.62 | smd 1.4 x 2: S1 -7.9,2.85; S2 7.9,2.85 | smd 1.28 x 1.4: S3 7.96,-6.75 | smd 1.95 x 1.4: S4 -7.025,-6.75 | hole 1.25: -3.1,3.25; 4.9,3.25
SOP65P640X120-20N = smd 1.473 x 0.356: 1 -2.921,2.921; 2 -2.921,2.286; 3 -2.921,1.626; 4 -2.921,0.965; 5 -2.921,0.33; 6 -2.921,-0.33; 7 -2.921,-0.965; 8 -2.921,-1.626; 9 -2.921,-2.286; 10 -2.921,-2.921; 11 2.921,-2.921; 12 2.921,-2.286; 13 2.921,-1.626; 14 2.921,-0.965; 15 2.921,-0.33; 16 2.921,0.33; 17 2.921,0.965; 18 2.921,1.626; 19 2.921,2.286; 20 2.921,2.921
SO08 = smd 0.6 x 1.2: 1 -1.905,-2.8; 2 -0.635,-2.8; 3 0.635,-2.8; 4 1.905,-2.8; 5 1.905,2.8; 6 0.635,2.8; 7 -0.635,2.8; 8 -1.905,2.8
TQFP100 = smd 1.5 x 0.3: 1 -8,6; 2 -8,5.5; 3 -8,5; 4 -8,4.5; 5 -8,4; 6 -8,3.5; 7 -8,3; 8 -8,2.5; 9 -8,2; 10 -8,1.5; 11 -8,1; 12 -8,0.5; 13 -8,0; 14 -8,-0.5; 15 -8,-1; 16 -8,-1.5; 17 -8,-2; 18 -8,-2.5; 19 -8,-3; 20 -8,-3.5; 21 -8,-4; 22 -8,-4.5; 23 -8,-5; 24 -8,-5.5; 25 -8,-6; 51 8,-6; 52 8,-5.5; 53 8,-5; 54 8,-4.5; 55 8,-4; 56 8,-3.5; 57 8,-3; 58 8,-2.5; 59 8,-2; 60 8,-1.5; 61 8,-1; 62 8,-0.5; 63 8,0; 64 8,0.5; 65 8,1; 66 8,1.5; 67 8,2; 68 8,2.5; 69 8,3; 70 8,3.5; 71 8,4; 72 8,4.5; 73 8,5; 74 8,5.5; 75 8,6 | smd 0.3 x 1.5: 26 -6,-8; 27 -5.5,-8; 28 -5,-8; 29 -4.5,-8; 30 -4,-8; 31 -3.5,-8; 32 -3,-8; 33 -2.5,-8; 34 -2,-8; 35 -1.5,-8; 36 -1,-8; 37 -0.5,-8; 38 0,-8; 39 0.5,-8; 40 1,-8; 41 1.5,-8; 42 2,-8; 43 2.5,-8; 44 3,-8; 45 3.5,-8; 46 4,-8; 47 4.5,-8; 48 5,-8; 49 5.5,-8; 50 6,-8; 76 6,8; 77 5.5,8; 78 5,8; 79 4.5,8; 80 4,8; 81 3.5,8; 82 3,8; 83 2.5,8; 84 2,8; 85 1.5,8; 86 1,8; 87 0.5,8; 88 0,8; 89 -0.5,8; 90 -1,8; 91 -1.5,8; 92 -2,8; 93 -2.5,8; 94 -3,8; 95 -3.5,8; 96 -4,8; 97 -4.5,8; 98 -5,8; 99 -5.5,8; 100 -6,8
SOP50P490X110-10N = smd 1.47 x 0.28: 1 -2.15,1; 2 -2.15,0.5; 3 -2.15,0; 4 -2.15,-0.5; 5 -2.15,-1; 6 2.15,-1; 7 2.15,-0.5; 8 2.15,0; 9 2.15,0.5; 10 2.15,1
SOT229P700X180-4N = smd 0.93 x 1.31: 1 -2.29,-3.345; 2 0,-3.345; 3 2.29,-3.345 | smd 3.24 x 1.31: 4 0,3.345
ATMEL_ATWINC1500-MR210PA = smd 0.8 x 1.9: J1 -8.189,-7.368; J2 -7.173,-7.368; J3 -6.157,-7.368; J4 -5.141,-7.368; J5 -1.077,-7.368; J6 0.955,-7.368; J7 1.971,-7.368; J8 2.987,-7.368; J9 4.003,-7.368; J10 1.962,7.362; J11 0.946,7.362; J12 -0.07,7.362; J13 -1.086,7.362; J14 -2.102,7.362; J15 -3.118,7.362; J16 -4.134,7.362; J17 -5.15,7.362; J18 -6.166,7.362; J19 -7.182,7.362 | smd 1.9 x 0.8: J20 -10.861,5.462; J21 -10.861,2.414; J22 -10.861,1.398; J23 -10.861,0.382; J24 -10.861,-0.634; J25 -10.861,-1.65; J26 -10.861,-2.666; J27 -10.861,-3.682; J28 -10.861,-4.698
TO170P1524X483-6N = smd 3.79 x 0.99: 1 -6.4,3.4; 2 -6.4,1.7; 3 -6.4,0; 4 -6.4,-1.7; 5 -6.4,-3.4 | smd 7.88 x 10.84: 6 4.35,0
MSTBA2 = drill 1.397 long: 1 -2.54,5.08; 2 2.54,5.08
MSTBA4 = drill 1.397 long: 1 -7.62,5.08; 2 -2.54,5.08; 3 2.54,5.08; 4 7.62,5.08
0204/7 = drill 0.813 octagon: 1 -3.81,0; 2 3.81,0

### Placement (x,y rotation side)
C1  7.49,19.94 270 top
C2  5.08,19.94 270 top
C3  2.79,19.94 270 top
C4  83.31,77.09 180 top
C13  14.22,65.66 180 top
C14  58.93,70.36 90 top
C15  7.37,73.41 270 top
C16  66.55,67.18 270 top
C17  22.86,52.96 270 top
C18  15.24,56.13 90 top
C19  74.8,22.99 90 top
C20  82.68,22.86 90 top
C21  75.06,57.28 270 top
C22  96.77,43.81 90 top
C23  93.73,43.81 90 top
C24  90.93,43.81 90 top
C25  149.22,77.72 270 top
C26  151.76,77.72 270 top
C27  144.65,46.86 0 top
C28  137.16,77.72 270 top
C29  139.83,77.72 270 top
D1  91.31,80.52 180 top
D4  13.59,93.6 180 bottom
D5  26.16,59.18 0 top
D6  7.24,82.17 270 top
D7  109.47,71.5 0 top
D8  114.55,71.5 0 top
D9  119.89,71.5 0 top
D10  125.35,71.37 0 top
D11  149.48,93.85 180 bottom
D12  139.32,93.47 180 bottom
D13  146.69,77.47 90 bottom
D14  134.75,77.72 90 bottom
D15  154.43,77.85 90 bottom
D16  142.24,77.85 90 bottom
F1  88.9,85.09 0 top
F2  66.93,73.15 90 top
F3  96.01,84.96 180 top
FB1  140.46,48.39 0 top
FB2  139.7,45.85 0 top
J2  62.87,30.99 0 top
K2  36.83,12.19 0 top
L2  45.21,70.23 270 top
LED1  27.05,37.34 90 top
LED2  29.08,53.09 180 top
LED3  27.05,39.24 90 top
LED4  26.54,42.55 90 top
Q1  65.28,24.89 0 top
Q3  54.23,84.2 90 top
Q4  78.23,29.84 180 top
R1  64.52,47.5 90 top
R2  57.15,36.83 0 top
R3  11.68,24.51 270 top
R4  31.24,42.67 0 top
R5  31.37,39.24 0 top
R6  31.37,36.58 0 top
R7  44.2,84.33 90 top
R8  40.89,84.2 90 top
R9  48.01,83.95 90 top
R10  25.91,52.96 90 top
R11  52.83,27.81 180 top
R12  78.74,23.88 180 top
R13  109.98,80.52 180 top
R14  115.19,80.64 180 top
R15  120.27,80.64 180 top
R16  125.35,80.77 180 top
R17  109.98,75.31 0 top
R18  115.19,75.31 0 top
R19  120.27,75.18 0 top
R20  125.48,75.18 0 top
R21  150.75,83.57 0 top
R22  154.56,82.55 90 top
R23  146.81,82.68 90 top
R24  146.81,77.72 90 top
R25  154.56,77.72 90 top
R26  138.43,83.44 0 top
R27  142.24,82.55 90 top
R28  134.75,82.55 90 top
R29  134.75,77.72 90 top
R30  142.24,77.72 90 top
R31  151.38,51.05 90 top
R32  148.97,51.05 90 top
R33  26.16,32.13 90 top
R34  28.45,32.13 90 top
R35  9.4,24.51 90 top
R36  13.97,24.51 90 top
R37  56.01,47.88 270 top
R38  58.67,48.13 270 top
R39  61.47,47.5 270 top
R40  65.28,20.83 0 top
R41  68.71,26.04 180 top
R42  11.18,19.05 180 top
R43  83.06,79.88 0 top
R44  87.88,80.9 90 top
R45  94.87,80.9 270 top
S2  50.67,23.24 0 top
SD1  18.03,8 180 top
U1  55.75,42.29 180 top
U2  91.06,74.3 0 top
U3  80.01,45.72 0 top
U4  143.51,52.07 180 top
U5  143.64,61.47 90 top
U6  5.21,57.02 0 top
U$14  12.7,35.56 180 top
VR2  29.97,73.28 90 top
X1  92.08,93.98 180 top
X2  13.46,93.98 180 top
X3  119.25,93.98 180 top
X4  144.78,94.11 180 top
ZENER1  58.8,83.95 270 top

### Tracks (layer width: path | path; a pad name or v marks a point on that pad's centre or on a via)
3.3V  (via drill 0.35)
  Top 0.305: R4.2 32.19,39.37 R5.2 R6.2 32.32,35.18 U$14.J23 23.5,35.12 21.84,35.12 21.84,31.37 | C1.1 C2.1 C3.1 2.79,23.5 2.86,23.56 7.75,23.56 | 21.84,31.37 21.84,29.97 23.43,29.97 U$14.J20 | 58.42,39.37 U1.20 51.31,39.37 41.02,29.08 24.58,29.08 U$14.J20 | 58.42,39.37 U1.1 | R40.1 Q1.1 61.2,23.89 v60.96,24.13 | v58.42,38.48 58.42,39.37 | 7.75,23.56 R35.1 9.4,21.84 v9.65,21.84 | 7.75,23.56 7.75,30.1 v9.27,30.1 | v20.95,30.1 20.95,31.37 21.84,31.37 | U$14.J20 23.56,31.18 R33.1 | 13.97,22.1 v13.97,20.45 13.52,20.45 R42.1 | 13.97,22.1 R36.1 | SD1.4 16.89,15.66 v16.89,16.89 | v13.34,22.1 13.97,22.1
  Top 0.381: C18.+ 16.14,60.63 | 30.48,48.64 30.61,48.51 v30.61,48.26
  Top 0.457: U6.2 12.16,60.63 C18.+ 15.24,60.26 21.59,53.91 | C17.1 21.59,53.91 | 21.59,53.91 21.52,53.91 21.52,48.71 21.59,48.64 30.48,48.64 | R4.2 32.59,42.67 v33.61,43.69
  Bottom 0.305: v60.96,24.13 60.71,24.13 58.42,26.42 v58.42,38.48 | v9.27,30.1 v20.95,30.1 | v13.97,20.45 13.97,18.97 16.05,16.89 v16.89,16.89 | v9.65,21.84 9.91,22.1 v13.34,22.1
  Bottom 0.381: 33.66,43.94 33.66,43.74 v33.61,43.69
  Bottom 0.457: 33.66,43.94 30.61,46.99 v30.61,48.26
5V  (via drill 0.35)
  Top 0.305: U3.10 72.52,47.22 | 72.52,47.22 74.04,47.22 | 74.04,47.22 74.93,47.22 76.58,47.22 | 76.58,47.22 84.07,47.22 | 84.07,47.22 84.33,47.22 86.83,44.72 U3.61 90.89,44.72 C24.2 C23.2 C22.2 98.87,44.77 v98.93,44.7 | U3.31 76.51,47.15 76.58,47.22 | 74.01,47.25 74.04,47.22 | 84.01,47.28 84.07,47.22 | R11.2 51.88,32.45 51.94,32.51 57.91,32.51 | 57.91,32.51 60.07,32.51 J2.2 60.33,32.7 R2.1 56.2,37.02 v54.86,38.35 | 72.52,47.22 72.52,47.27 70.89,47.27 68.27,49.89 61.47,49.89 R39.1 60.83,49.08 R38.1 56.26,49.08 R37.1 54.04,48.83 53.85,48.64 53.85,45.54 53.87,45.52 53.87,45.44 55.24,44.07 55.24,40.26 v55.12,40.13 | R41.1 69.66,27.43 v64.39,27.43 | v59.13,27.3 57.91,27.3 57.91,32.51 | U2.8 C4.1 | 82.11,79.24 82.11,79.63 | 82.11,79.63 R43.1 | FB1.1 139.49,48.26 | U3.100 74.01,51.66 73.98,51.63 | C4.1 84.26,74.99 v84.2,74.93 | C4.1 82.86,78.49 82.04,78.49 82.04,79.56 82.11,79.63
  Top 0.381: U6.3 8.64,52.53 8.64,47.37 31.75,47.37 | LED2.A 31.75,51.47 31.75,47.37 | 31.75,47.37 32.64,47.37 46.48,61.21 64.14,61.21 | 64.14,61.21 68.83,65.91 68.83,74.55 F2.2 72.26,79.88 R43.1 | 139.49,48.26 v137.92,48.26 | 64.14,61.21 73.53,52.07 73.98,51.63 74.93,50.67 74.93,47.22 | U3.80 84.01,54.93 v84.2,55.12
  Bottom 0.305: v59.13,27.3 59.13,27.43 v64.39,27.43 | v55.12,40.13 55.12,38.61 v54.86,38.35
  Bottom 0.381: v137.92,48.26 102.49,48.26 v98.93,44.7 | v84.2,55.12 84.2,59.69 v84.2,74.93
12V
  Top 0.254: R8.2 44.07,85.15 R7.2
  Top 0.635: VR2.1 15.25,66.88 | C13.1 15.25,65.74 15.25,66.88 | 15.25,66.88 15.25,68.06 C15.+ 7.37,80.02 | D6.C 7.37,80.02 | 7.37,80.02 20.84,80.02 23.43,82.61 37.47,82.61 40.01,85.15 R8.2
!ATWINC_IRQ
  Top 0.305: R36.2 13.97,28.01 U$14.J13 13.79,32.2 16,34.42 16,46.1 16.38,46.48 27.94,46.48 50.42,46.48 54.28,50.34 69.08,50.34 70.2,49.22 U3.6
!ATWINC_RST_3V
  Top 0.305: U1.12 27.94,44.58 17.78,44.58 17.78,42.99 U$14.J4
!ATWINC_RST_5V
  Top 0.305: U3.17 71.97,43.77 71.13,43.77 70.45,44.45 61.47,44.45 | 61.47,44.45 R39.2 R1.1 | U1.8 59.65,43.92 60.19,44.45 61.47,44.45
AGND  (via drill 0.35)
  Top 0.305: FB2.2 140.55,45.59 145.8,45.59 145.8,46.86 C27.2 145.73,46.86 R32.1 | C29.2 139.83,72.77 140.08,72.52 v142.32,72.52 142.49,72.52 | v146.81,72.52 R24.1
  Bottom 0.305: v142.32,72.52 v146.81,72.52
  pour Top: 132.97,99.44 132.97,47.5 159.26,47.5 159.26,99.57 132.97,99.57
  pour Bottom: 132.59,99.57 132.59,47.5 159.26,47.5 159.26,99.69 132.72,99.69
AIN0  (via drill 0.35)
  Top 0.305: C26.1 153.29,77.15 | 153.29,77.15 153.66,76.77 R25.1 | U4.4 147.12,52.58 147.12,58.42 147.12,58.88 U5.1 v147.83,59.56 | 153.29,77.15 153.29,68.07 v153.16,67.94 v153.16,61.98
  Bottom 0.305: v147.83,59.56 151,59.56 153.16,61.72 v153.16,61.98
AIN1  (via drill 0.35)
  Top 0.305: C29.1 141.73,76.77 R30.1 143,76.01 143,68.71 137.79,63.5 137.79,60.96 137.92,60.83 U5.7 141.99,60.83 143.64,59.18 v143.64,54.1 | v145.67,53.98 U4.5
  Bottom 0.305: v143.64,54.1 145.67,54.1 v145.67,53.98
ANI_1
  Top 0.305: R20.2 126.59,75.02 | 126.59,75.02 127,74.61 D10.- 122.68,67.06 94.99,67.06 83.01,55.08 U3.82 | R16.1 126.59,80.48 126.59,75.02
ANI_2
  Top 0.305: R15.1 R19.2 121.54,74.86 D9.- 117.59,67.56 94.78,67.56 82.51,55.29 U3.83
ANI_3
  Top 0.305: R14.1 R18.2 116.14,71.57 D8.- 112.76,68.06 94.57,68.06 82.01,55.49 U3.84
ANI_4
  Top 0.305: R13.1 R17.2 111.12,75.12 D7.- 111.12,68.56 94.36,68.56 81.51,55.7 U3.85
ATWINC_EN_3V
  Top 0.305: U1.18 52.78,40.62 50.7,40.62 41.27,31.18 R34.1
ATWINC_EN_5V
  Top 0.305: U1.2 59.28,40.01 59.45,40.17 61.21,40.17 | 61.21,40.17 71.46,40.17 71.5,40.22 U3.24 | R2.2 61.21,39.94 61.21,40.17
ATWINC_SSN_3V  (via drill 0.35)
  Top 0.305: U$14.J16 16.83,44.77 17.78,45.72 v50.8,45.72 | v49.28,43.18 49.35,43.26 U1.14
  Bottom 0.305: v49.28,43.18 49.28,44.2 v50.8,45.72
ATWINC_SSN_5V
  Top 0.305: U3.19 71.97,42.76 70.84,42.76 70.3,43.31 60.46,43.31 59.8,42.65 58.7,42.65 U1.6 57.96,42.62 56.74,43.84 56.74,45.25 R38.2
GND  (via drill 0.35)
  Top 0.305: v60.07,45.13 59.99,45.21 U1.10 | v92.35,79.35 91.48,79.35 D1.3 | v93.98,77.09 U2.5 | U1.19 54.09,40.01 v54.21,40.12
  Bottom 0.305: v60.07,45.13 60.12,45.13 60.2,45.21 59.56,45.85 58.17,45.85 57.53,45.21 53.98,45.21 53.95,45.19 53.95,40.38 v54.21,40.12 | v93.98,77.09 92.52,78.55 92.52,79.18 v92.35,79.35
  pour Top: 0.89,99.44 0.89,44.2 7.37,44.2 7.37,27.18 1.27,27.18 1.27,0.51 42.93,0.51 42.93,12.57 157.48,12.57 157.48,44.45 139.7,44.45 139.7,46.99 132.08,46.99 132.08,99.44
  pour Bottom: 1.27,99.06 1.27,44.58 7.11,44.58 7.11,27.56 0.76,27.56 0.76,0.51 43.05,0.51 43.05,12.06 157.48,12.06 157.48,44.45 139.7,44.45 139.7,46.99 132.08,46.99 132.08,99.69 1.27,99.69 1.27,99.19
MISO  (via drill 0.35)
  Top 0.305: v71.88,25.4 72.01,25.27 72.01,25.15 70.75,23.89 Q1.2 R40.2 66.23,18.48 v66.29,18.41 | U3.22 72.05,41.18 74.47,41.18 v74.47,41.15 | U$14.J17 17.85,21.27 18.29,20.83 19.3,20.83 | v41.03,20.82 v41.02,20.83 19.3,20.83 | SD1.7 13.63,18.33 16.13,20.83 v16.13,20.72 | v19.3,19.94 19.3,20.83
  Bottom 0.305: v71.88,25.4 71.88,36.96 74.55,39.62 74.55,41.15 v74.47,41.15 | v41.03,20.82 60.46,20.82 62.99,18.29 66.29,18.29 v66.29,18.41 | v16.13,20.72 16.91,19.94 v19.3,19.94
MISO_5V  (via drill 0.35)
  Top 0.305: J2.1 59.82,29.21 59.82,26.04 v59.94,26.04 | v64.26,26.04 65.23,26.04 Q1.3 67.76,25.99 R41.2
  Bottom 0.305: v59.94,26.04 v64.26,26.04
MOSI  (via drill 0.35)
  Top 0.305: U1.4 60.53,41.33 61.48,42.28 63.5,42.28 | 63.5,42.28 70.03,42.28 70.59,41.72 U3.21 | v62.87,41.4 63.5,42.04 63.5,42.28 | J2.4 v62.87,34.54
  Bottom 0.305: v62.87,34.54 v62.87,41.4
MOSI_3V  (via drill 0.35)
  Top 0.305: U1.16 52.81,41.94 49.94,41.94 41.02,33.02 v31.75,33.02 | U$14.J15 15.75,28.13 v15.75,25.53 15.75,22.61 18.03,20.32 SD1.3
  Bottom 0.305: v15.75,25.53 15.75,25.15 25.15,25.15 31.75,31.75 v31.75,33.02
N$1
  Top 0.305: LED1.C 25.11,38.23 U$14.J26
N$2
  Top 0.305: LED3.C U$14.J27
N$3
  Top 0.635: VR2.2 28.31,66.84 D5.C 35.81,59.18 42.01,65.38 L2.2
N$4
  Top 0.305: LED3.A R5.1
N$5
  Top 0.305: LED1.A 29.66,37.34 R6.1
N$6
  Top 0.305: LED4.C 24.6,43.44 21.4,43.44 U$14.J1
N$7
  Top 0.305: R4.1 30.16,42.55 LED4.A
N$8
  Top 0.305: R45.1 93.92,81.85 93.22,82.55 90.42,82.55 | 90.42,82.55 89.53,82.55 89.34,82.36 | 89.34,82.36 88.83,81.85 R44.2 87.88,84.71 F1.1 | D1.2 90.42,81.58 90.42,82.55 | U2.7 89.76,77.76 89.76,77.82 89.34,78.24 89.34,82.36
N$9
  Top 0.305: R3.1 11.68,28.13 U$14.J11
N$10
  Top 0.305: R35.2 9.4,26.86 U$14.J10
N$11
  Top 0.635: 45.24,75.06 45.78,74.51 C14.+ 64.17,74.51 F2.1 66.93,68.51 C16.1 | 45.24,75.06 L2.1 | VR2.4 31.67,62.56 32,62.23 33.66,62.23 41.15,69.72 41.15,75.06 45.24,75.06
N$12
  Top 0.635: D6.A 7.4,85.6 14.48,85.6 16,87.12 X2.2
  Bottom 0.635: D4.2 15.79,89.11 X2.2 X2.1
N$13
  Top 0.254: LED2.C 27.78,52.04 R10.2
N$14
  Top 0.254: Q3.1 56.39,84.41 56.39,85.34 | 56.39,85.34 56.39,86.23 49.34,86.23 R9.2 | ZENER1.1 56.39,85.34
N$15
  Top 0.254: R7.1 45.72,83.38 45.72,86.23 46.35,86.87 56.39,86.87 58.29,88.77 60.2,88.77 60.2,80.64 59.69,80.14 ZENER1.2
N$16
  Top 0.305: C20.2 82.61,23.88 R12.1 80.64,24.83 Q4.1 80.64,32.38 78.01,35.02 U3.34
N$17
  Top 0.305: C19.2 75.06,23.94 | 75.06,23.94 77.73,23.94 R12.2 | 75.06,23.94 75.82,24.7 Q4.2 75.82,33.27 77.51,34.97 U3.33
N$18
  Top 0.305: U3.98 C21.2
N$19
  Top 0.305: X3.4 109.09,86.36 109.09,80.58 R13.2
N$20
  Top 0.305: X3.3 114.17,86.36 114.17,80.71 R14.2
N$21
  Top 0.305: X3.2 119.25,86.36 119.25,80.71 R15.2
N$22
  Top 0.305: X3.1 124.4,86.43 R16.2
N$23
  Top 0.305: R21.2 154.49,83.57 R22.2 154.56,86.87 X4.1
N$24  (via drill 0.35)
  Top 0.305: R23.2 149.74,83.63 R21.1 149.8,89.86 152.02,92.08 153.67,92.08 153.67,93.85 v153.54,93.85
  Bottom 0.305: v153.54,93.85 D11.C
N$25  (via drill 0.35)
  Top 0.305: R23.1 R24.2 | R24.2 C25.1 149.48,78.93 v149.48,81.03 | R24.2 145.35,78.67 144.15,77.47 144.15,62.1 v144.02,61.98 | U5.3 146.31,61.98 v145.29,61.98
  Bottom 0.305: D13.2 148.09,81.03 v149.48,81.03 | v144.02,61.98 v145.29,61.98
N$26  (via drill 0.35)
  Top 0.305: v152.15,81.41 154.37,81.41 R22.1 R25.2 154.88,78.99 157.73,78.99 157.73,70.74 157.73,70.48 v157.73,68.83 | U5.2 v147.83,60.83
  Bottom 0.305: D15.2 153.3,80 152.02,81.28 v152.15,81.41 | v147.83,60.83 149.86,60.83 157.73,68.71 v157.73,68.83
N$27
  Bottom 0.305: D11.A X4.2
N$28
  Top 0.305: R26.2 142.18,83.44 R27.2 X4.3
N$29  (via drill 0.35)
  Top 0.305: R26.1 134.81,83.44 R28.2 140.59,89.34 140.59,90.81 141.35,91.57 143.76,91.57 143.76,93.73 v143.51,93.98
  Bottom 0.305: v143.51,93.98 143,93.47 D12.C
N$30  (via drill 0.35)
  Top 0.305: R29.2 C28.1 v137.16,80.01 | R28.1 R29.2 | U5.5 139.83,63.37 v139.7,63.5 | v133.22,78.61 134.69,78.61 R29.2
  Bottom 0.305: v139.7,63.5 133.1,70.1 133.1,78.61 v133.22,78.61 | D14.2 134.88,80.01 v137.16,80.01
N$31  (via drill 0.35)
  Top 0.305: 142.24,81.28 R30.2 142.31,78.74 143.51,78.74 143.51,68.45 138.3,63.25 138.3,61.72 140.46,61.72 U5.6 | 142.24,81.28 R27.1 | v139.7,80.01 140.97,81.28 142.24,81.28
  Bottom 0.305: D16.2 v139.7,80.01
N$32
  Bottom 0.305: X4.4 D12.A
N$33
  Top 0.305: R31.2 151.38,53.09 151.13,53.34 147.57,53.34 147.57,51.62 U4.2
N$34
  Top 0.305: U4.1 148.04,51.07 R32.2
N$35  (via drill 0.35)
  Top 0.305: R44.1 87.82,79.88 R43.2 85.53,78.36 v88.14,78.36 | 91.69,77.47 91.69,77.85 v91.19,78.36 | 91.69,77.47 U2.6 | D1.1 93.34,80.44 93.34,78.17 | F3.1 97.66,84.71 97.66,78.36 97.47,78.17 93.34,78.17 | 91.69,77.47 92.39,78.17 93.34,78.17
  Bottom 0.305: v88.14,78.36 v91.19,78.36
N$36
  Top 0.305: R34.2 R33.2 26.16,34.16 U$14.J22
N$37
  Top 0.305: X1.2 90.3,88.14 F1.2
N$38
  Top 0.305: X1.1 F3.2
ON/OFF
  Top 0.254: Q3.3 53.04,84.29 49.15,80.39 40.89,80.39 | 40.89,80.39 39.62,80.39 36.45,77.22 36.45,67.31 33.8,67.31 VR2.5 | R8.1 40.89,80.39
PROG_RX0  (via drill 0.35)
  Top 0.305: U3.2 69.85,51.22 69.72,51.35 v69.72,51.45
  Bottom 0.305: v69.72,51.45 40.02,51.45 35.05,46.48 35.05,17.78 35.05,17.4 35.08,17.4 K2.2
PROG_TX0  (via drill 0.35)
  Top 0.305: v38.1,50.8 69.4,50.8 69.48,50.72 U3.3
  Bottom 0.305: K2.3 34.29,16.19 34.29,47.12 37.97,50.8 v38.1,50.8
RESET
  Top 0.305: R11.1 53.78,26.04 | U3.30 76.01,35.5 70.23,29.72 J2.5 58.93,23.24 S2.2 54.04,23.45 54.04,26.04 53.78,26.04 | K2.1 47.21,26.04 53.78,26.04
RS485_CTRL  (via drill 0.35)
  Top 0.305: U3.76 86.01,55.85 v85.98,55.88 | v90.42,70.23 U2.2 U2.3
  Bottom 0.305: v85.98,55.88 85.98,65.79 v90.42,70.23
RS485_RX  (via drill 0.35)
  Top 0.305: U2.1 v89.15,65.15 | U3.63 89.41,45.72 v89.41,45.59
  Bottom 0.305: v89.41,45.59 89.15,45.59 v89.15,65.15
RS485_TX  (via drill 0.35)
  Top 0.305: U3.64 87.97,46.27 87.13,46.27 86.36,47.04 86.36,51.69 92.96,58.29 v92.96,63.25 | v93.09,70.23 92.96,70.36 U2.4
  Bottom 0.305: v92.96,63.25 92.96,70.23 v93.09,70.23
SCK  (via drill 0.35)
  Top 0.305: U1.5 60.39,41.96 61.22,42.79 70.17,42.79 70.7,42.26 71.97,42.26 | 71.97,42.26 U3.20 | J2.3 64.14,30.99 68.2,30.99 v68.2,31.11 | v73.66,42.29 73.63,42.26 71.97,42.26
  Bottom 0.305: v68.2,31.11 68.2,34.16 73.79,39.75 73.79,42.29 v73.66,42.29
SCK_3V  (via drill 0.35)
  Top 0.305: U1.15 49.73,42.62 41.02,33.91 37.21,33.91 v37.21,33.7 | v36.96,27.05 35.94,26.04 27.81,26.04 | 27.81,26.04 18.92,26.04 18.87,26.09 U$14.J18 | SD1.5 15.83,17.78 v16.64,17.78 | v27.81,25.15 27.81,26.04
  Bottom 0.305: v37.21,33.7 37.21,27.05 v36.96,27.05 | v16.64,17.78 20.32,17.78 27.69,25.15 v27.81,25.15
SCL
  Top 0.305: U3.43 82.51,36.83 82.51,36.15 82.8,35.86 123.82,35.86 139.03,51.07 U4.10
SD_CS_3V  (via drill 0.35)
  Top 0.305: SD1.2 19.13,17.1 22.23,20.19 37.34,20.19 v37.34,20.14 | v50.29,41.25 50.37,41.33 U1.17
  Bottom 0.305: v37.34,20.14 37.34,24.59 50.04,37.29 50.04,41.27 50.27,41.27 v50.29,41.25
SD_CS_5V
  Top 0.305: 59.12,40.72 59.07,40.66 U1.3 | U3.23 59.12,40.72 | 59.12,40.72 57.81,40.72 56.13,42.39 56.13,46.8 R37.2
SD_DETECT  (via drill 0.35)
  Top 0.305: SD1.9 11.43,17.84 R42.2 8.89,20.39 8.89,22.23 4.7,22.23 v4.7,22.73 | v70.1,52.45 70.83,51.72 U3.1
  Bottom 0.305: v4.7,22.73 4.7,24.26 8.26,27.81 8.26,48.51 9.14,49.4 35.31,49.4 39.62,53.72 68.58,53.72 69.85,52.45 v70.1,52.45
SDA
  Top 0.305: U3.44 83.01,36.83 83.01,36.36 123.61,36.36 138.8,51.55 139.7,51.55 140.08,51.55 141.34,51.55 U4.9
VCCA  (via drill 0.35)
  Top 0.305: 143.7,48.26 143.7,50.51 142.4,51.82 | 143.7,48.26 C27.1 142.18,48.39 FB1.2 142.4,49.48 142.4,51.82 | v151,48.51 151.38,48.9 R31.1 | U5.8 139.7,59.56 | 139.7,59.56 138.18,59.56 134.49,63.25 134.49,72.9 v134.75,73.15 | 142.4,51.82 142.15,52.07 U4.8 139.7,52.07 139.7,59.56 | v144.78,48.26 143.7,48.26
  Bottom 0.305: D15.1 154.05,75.32 D13.1 142.62,75.32 D16.1 142.11,75.57 D14.1 v134.75,73.15 | v151,48.51 150.75,48.26 v144.78,48.26
WAKE_3V  (via drill 0.35)
  Top 0.305: R3.2 12.32,22.93 12.32,21.72 12.19,21.59 12.26,21.53 v12.13,21.4 | v33.15,34.8 42.27,43.92 45.72,43.92 U1.13
  Bottom 0.305: v12.13,21.4 22.29,21.4 33.15,32.26 v33.15,34.8
WAKE_5V
  Top 0.305: U1.7 59.64,43.26 60.2,43.81 70.44,43.81 70.99,43.26 71.97,43.26 U3.18